# EAGLE design Design_Electronic_Proiect (EAGLE 9.7.0)

## Sheet 1 of 2
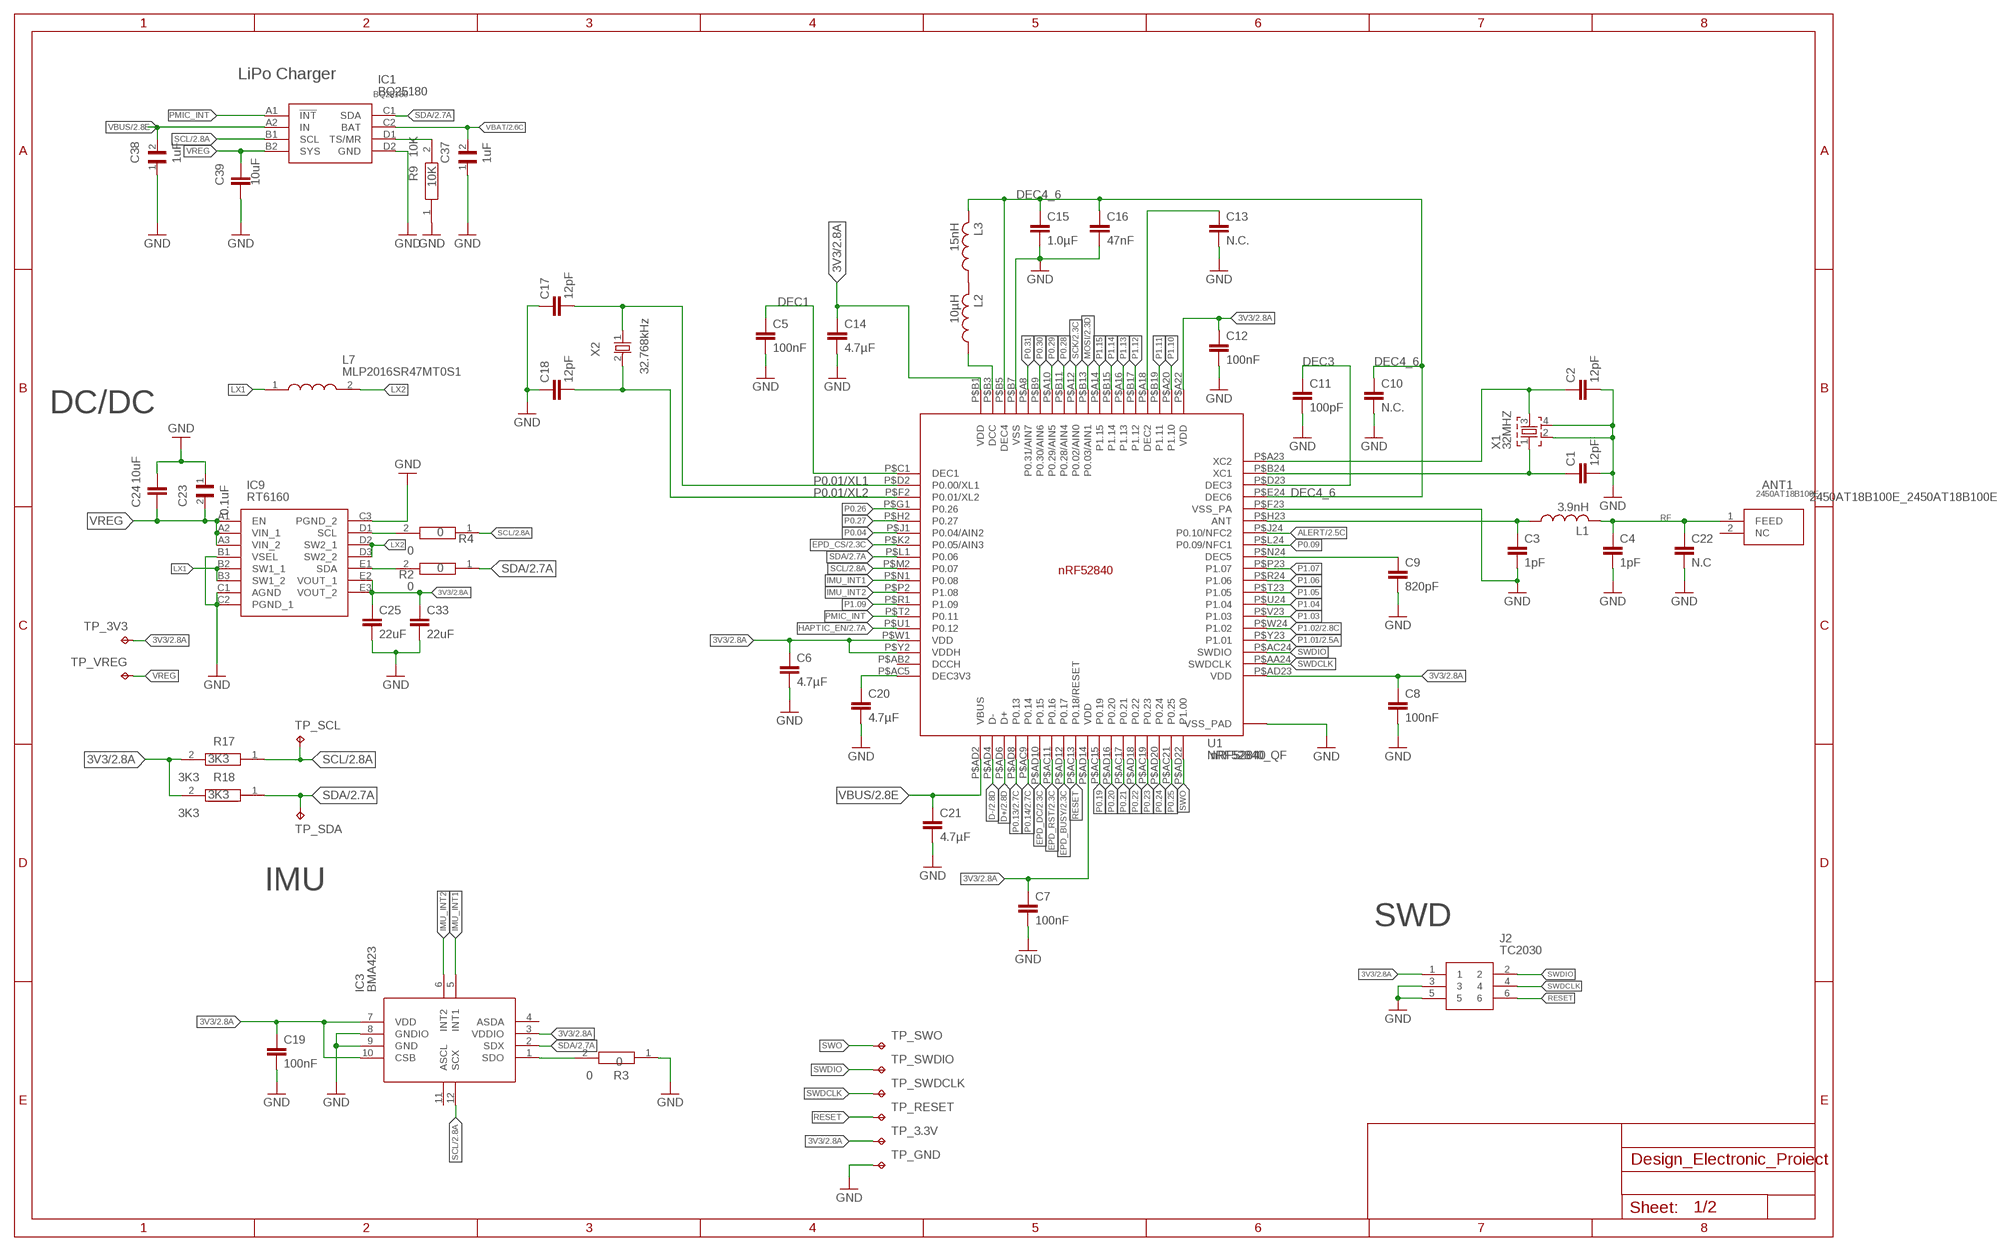
[diagram p0: schematic, sheet 1]

### Parts
ANT1  2450AT18B100E_2450AT18B100E  [2450AT18B100E_ANTC3216X140N]
C1  12pF  NORDIC_NRF_3_CAPACITOR_0201_L  [NORDIC_NRF_3_RESC0201_L]
C2  12pF  NORDIC_NRF_3_CAPACITOR_0201_L  [NORDIC_NRF_3_RESC0201_L]
C3  1pF  NORDIC_NRF_3_CAPACITOR_0201_L  [NORDIC_NRF_3_RESC0201_L]
C4  1pF  NORDIC_NRF_3_CAPACITOR_0201_L  [NORDIC_NRF_3_RESC0201_L]
C5  100nF  NORDIC_NRF_3_CAPACITOR_0201_L  [NORDIC_NRF_3_RESC0201_L]
C6  4.7µF  NORDIC_NRF_3_CAPACITOR_0201_L  [NORDIC_NRF_3_RESC0201_L]
C7  100nF  NORDIC_NRF_3_CAPACITOR_0201_L  [NORDIC_NRF_3_RESC0201_L]
C8  100nF  NORDIC_NRF_3_CAPACITOR_0201_L  [NORDIC_NRF_3_RESC0201_L]
C9  820pF  NORDIC_NRF_3_CAPACITOR_0201_L  [NORDIC_NRF_3_RESC0201_L]
C10  N.C.  NORDIC_NRF_3_CAPACITOR_0201_L  [NORDIC_NRF_3_RESC0201_L]
C11  100pF  NORDIC_NRF_3_CAPACITOR_0201_L  [NORDIC_NRF_3_RESC0201_L]
C12  100nF  NORDIC_NRF_3_CAPACITOR_0201_L  [NORDIC_NRF_3_RESC0201_L]
C13  N.C.  NORDIC_NRF_3_CAPACITOR_0201_L  [NORDIC_NRF_3_RESC0201_L]
C14  4.7µF  NORDIC_NRF_3_CAPACITOR_0201_L  [NORDIC_NRF_3_RESC0201_L]
C15  1.0µF  NORDIC_NRF_3_CAPACITOR_0201_L  [NORDIC_NRF_3_RESC0201_L]
C16  47nF  NORDIC_NRF_3_CAPACITOR_0201_L  [NORDIC_NRF_3_RESC0201_L]
C17  12pF  NORDIC_NRF_3_CAPACITOR_0201_L  [NORDIC_NRF_3_RESC0201_L]
C18  12pF  NORDIC_NRF_3_CAPACITOR_0201_L  [NORDIC_NRF_3_RESC0201_L]
C19  100nF  NORDIC_NRF_3_CAPACITOR_0402_L  [NORDIC_NRF_3_RESC0402_L]
C20  4.7µF  NORDIC_NRF_3_CAPACITOR_0201_L  [NORDIC_NRF_3_RESC0201_L]
C21  4.7µF  NORDIC_NRF_3_CAPACITOR_0201_L  [NORDIC_NRF_3_RESC0201_L]
C22  N.C  NORDIC_NRF_3_CAPACITOR_0201_L  [NORDIC_NRF_3_RESC0201_L]
C23  0.1uF  GRM011R60J152KE01L_2_GRM011R60J152KE01L  [GRM011R60J152KE01L_2_CAPC0201X13N]
C24  10uF  NORDIC_NRF_3_CAPACITOR_0402_L  [NORDIC_NRF_3_RESC0402_L]
C25  22uF  NORDIC_NRF_3_CAPACITOR_0402_L  [NORDIC_NRF_3_RESC0402_L]
C33  22uF  NORDIC_NRF_3_CAPACITOR_0402_L  [NORDIC_NRF_3_RESC0402_L]
C37  1uF  GRM011R60J152KE01L_2_GRM011R60J152KE01L  [GRM011R60J152KE01L_2_CAPC0201X13N]
C38  1uF  GRM011R60J152KE01L_2_GRM011R60J152KE01L  [GRM011R60J152KE01L_2_CAPC0201X13N]
C39  10uF  NORDIC_NRF_3_CAPACITOR_0402_L  [NORDIC_NRF_3_RESC0402_L]
IC1  BQ25180  BQ25180YBGR_BQ25180YBGR  [BQ25180YBGR_BGA8C40P2X4_100X155X50]
IC3  BMA423  BMA423_BMA423  [BMA423_BMA423]
IC9  RT6160  RT6160AWSC_RT6160AWSC  [RT6160AWSC_BGA15C40P3X5_140X230X60]
J2  TC2030  TC2030-IDC_TC2030-IDC  [TC2030-IDC_TC2030IDC]
L1  3.9nH  NORDIC_NRF_2_INDUCTOR_0402_L  [NORDIC_NRF_2_RESC0402_L]
L2  10µH  NORDIC_NRF_2_INDUCTOR_0402_L  [NORDIC_NRF_2_RESC0402_L]
L3  15nH  NORDIC_NRF_2_INDUCTOR_0402_L  [NORDIC_NRF_2_RESC0402_L]
L7  MLP2016SR47MT0S1  MLP2016SR47MT0S1_FTC252012SR47MBCA  [MLP2016SR47MT0S1_INDC2016X100N]
R2  0  CPF0201D7K68C1_CPF0201D7K68C1  [CPF0201D7K68C1_0201]
R3  0  CPF0201D7K68C1_CPF0201D7K68C1  [CPF0201D7K68C1_0201]
R4  0  CPF0201D7K68C1_CPF0201D7K68C1  [CPF0201D7K68C1_0201]
R9  10K  CPF0201D7K68C1_CPF0201D7K68C1  [CPF0201D7K68C1_0201]
R17  3K3  CPF0201D7K68C1_CPF0201D7K68C1  [CPF0201D7K68C1_0201]
R18  3K3  CPF0201D7K68C1_CPF0201D7K68C1  [CPF0201D7K68C1_0201]
TP_3.3V  HECTOR_WATCH_1_TPTP20R  [HECTOR_WATCH_1_TP20R]
TP_3V3  HECTOR_WATCH_1_TPTP20R  [HECTOR_WATCH_1_TP20R]
TP_GND  HECTOR_WATCH_1_TPTP20R  [HECTOR_WATCH_1_TP20R]
TP_RESET  HECTOR_WATCH_1_TPTP20R  [HECTOR_WATCH_1_TP20R]
TP_SCL  HECTOR_WATCH_1_TPTP20R  [HECTOR_WATCH_1_TP20R]
TP_SDA  HECTOR_WATCH_1_TPTP20R  [HECTOR_WATCH_1_TP20R]
TP_SWDCLK  HECTOR_WATCH_1_TPTP20R  [HECTOR_WATCH_1_TP20R]
TP_SWDIO  HECTOR_WATCH_1_TPTP20R  [HECTOR_WATCH_1_TP20R]
TP_SWO  HECTOR_WATCH_1_TPTP20R  [HECTOR_WATCH_1_TP20R]
TP_VREG  HECTOR_WATCH_1_TPTP20R  [HECTOR_WATCH_1_TP20R]
U1  nRF52840  NORDIC_NRF_4_NRF52840_QF  [NORDIC_NRF_4_AQFN50P700X700X85_HS-74N]
X1  32MHZ  NORDIC_NRF_XTAL_32MHZ  [NORDIC_NRF_BT-XTAL_2016_N]
X2  32.768kHz  NORDIC_NRF_1_XTAL_32KHZ  [NORDIC_NRF_1_XTAL_3215_N]

### Nets
3V3: C6.1 C7.1 C8.1 C12.1 C14.1 C19.1 C25.1 C33.1 IC3.3(VDDIO) IC3.7(VDD) IC3.10(CSB) IC9.E2(VOUT_1) IC9.E3(VOUT_2) J2.1 R17.2 R18.2 TP_3.3V.TP TP_3V3.TP U1.P$A22(VDD) U1.P$AD14(VDD) U1.P$AD23(VDD) U1.P$B1(VDD) U1.P$W1(VDD) U1.P$Y2(VDDH) ; also sheet 2
ALERT: U1.P$J24(P0.10/NFC2) ; also sheet 2
D+: U1.P$AD6(D+) ; also sheet 2
D-: U1.P$AD4(D-) ; also sheet 2
DEC1: C5.1 U1.P$C1(DEC1)
DEC3: C11.1 U1.P$D23(DEC3)
DEC4_6: C10.1 C15.1 C16.1 L3.2 U1.P$B5(DEC4) U1.P$E24(DEC6)
EPD_BUSY: U1.P$AD12(P0.17) ; also sheet 2
EPD_CS: U1.P$K2(P0.05/AIN3) ; also sheet 2
EPD_DC: U1.P$AD10(P0.15) ; also sheet 2
EPD_RST: U1.P$AC11(P0.16) ; also sheet 2
GND: C1.2 C2.2 C3.2 C4.2 C5.2 C6.2 C7.2 C8.2 C9.2 C10.2 C11.2 C12.2 C13.2 C14.2 C15.2 C16.2 C17.1 C18.1 C19.2 C20.2 C21.2 C22.2 C23.1 C24.1 C25.2 C33.2 C37.1 C38.1 C39.2 IC1.D2(GND) IC3.8(GNDIO) IC3.9(GND) IC9.B1(VSEL) IC9.C1(AGND) IC9.C2(PGND_1) IC9.C3(PGND_2) J2.3 J2.5 R3.1 R9.1 TP_GND.TP U1.P$74(VSS_PAD) U1.P$75(VSS_PAD) U1.P$76(VSS_PAD) U1.P$77(VSS_PAD) U1.P$78(VSS_PAD) U1.P$79(VSS_PAD) U1.P$80(VSS_PAD) U1.P$81(VSS_PAD) U1.P$82(VSS_PAD) U1.P$83(VSS_PAD) U1.P$84(VSS_PAD) U1.P$85(VSS_PAD) U1.P$86(VSS_PAD) U1.P$87(VSS_PAD) U1.P$88(VSS_PAD) U1.P$89(VSS_PAD) U1.P$90(VSS_PAD) U1.P$B7(VSS) U1.P$F23(VSS_PA) X1.2 X1.4 ; also sheet 2
HAPTIC_EN: U1.P$U1(P0.12) ; also sheet 2
IMU_INT1: IC3.5(INT1) U1.P$N1(P0.08)
IMU_INT2: IC3.6(INT2) U1.P$P2(P1.08)
LX1: IC9.B2(SW1_1) IC9.B3(SW1_2) L7.1
LX2: IC9.D2(SW2_1) IC9.D3(SW2_2) L7.2
MOSI: U1.P$B13(P0.03/AIN1) ; also sheet 2
N$1: C20.1 U1.P$AC5(DEC3V3)
N$2: C9.1 U1.P$N24(DEC5)
N$3: C3.1 L1.1 U1.P$H23(ANT)
N$4: C1.1 U1.P$B24(XC1) X1.1
N$5: C2.1 U1.P$A23(XC2) X1.3
N$6: L2.1 U1.P$B3(DCC)
N$7: L2.2 L3.1
N$8: C13.1 U1.P$A18(DEC2)
N$9: IC1.D1(TS/MR) R9.2
N$10: IC9.D1(SCL) R4.2
N$11: IC9.E1(SDA) R2.2
N$15: IC3.1(SDO) R3.2
P0.01/XL1: C17.2 U1.P$D2(P0.00/XL1) X2.1
P0.01/XL2: C18.2 U1.P$F2(P0.01/XL2) X2.2
P0.04: U1.P$J1(P0.04/AIN2)
P0.09: U1.P$L24(P0.09/NFC1)
P0.13: U1.P$AD8(P0.13) ; also sheet 2
P0.14: U1.P$AC9(P0.14) ; also sheet 2
P0.19: U1.P$AC15(P0.19)
P0.20: U1.P$AD16(P0.20)
P0.21: U1.P$AC17(P0.21)
P0.22: U1.P$AD18(P0.22)
P0.23: U1.P$AC19(P0.23)
P0.24: U1.P$AD20(P0.24)
P0.25: U1.P$AC21(P0.25)
P0.26: U1.P$G1(P0.26)
P0.27: U1.P$H2(P0.27)
P0.28: U1.P$B11(P0.28/AIN4)
P0.29: U1.P$A10(P0.29/AIN5)
P0.30: U1.P$B9(P0.30/AIN6)
P0.31: U1.P$A8(P0.31/AIN7)
P1.01: U1.P$Y23(P1.01) ; also sheet 2
P1.02: U1.P$W24(P1.02) ; also sheet 2
P1.03: U1.P$V23(P1.03)
P1.04: U1.P$U24(P1.04)
P1.05: U1.P$T23(P1.05)
P1.06: U1.P$R24(P1.06)
P1.07: U1.P$P23(P1.07)
P1.09: U1.P$R1(P1.09)
P1.10: U1.P$A20(P1.10)
P1.11: U1.P$B19(P1.11)
P1.12: U1.P$B17(P1.12)
P1.13: U1.P$A16(P1.13)
P1.14: U1.P$B15(P1.14)
P1.15: U1.P$A14(P1.15)
PMIC_INT: IC1.A1(!INT) U1.P$T2(P0.11)
RESET: J2.6 TP_RESET.TP U1.P$AC13(P0.18/RESET)
RF: ANT1.1(FEED) C4.1 C22.1 L1.2
SCK: U1.P$A12(P0.02/AIN0) ; also sheet 2
SCL: IC1.B1(SCL) IC3.12(SCX) R4.1 R17.1 TP_SCL.TP U1.P$M2(P0.07) ; also sheet 2
SDA: IC1.C1(SDA) IC3.2(SDX) R2.1 R18.1 TP_SDA.TP U1.P$L1(P0.06) ; also sheet 2
SWDCLK: J2.4 TP_SWDCLK.TP U1.P$AA24(SWDCLK)
SWDIO: J2.2 TP_SWDIO.TP U1.P$AC24(SWDIO)
SWO: TP_SWO.TP U1.P$AD22(P1.00)
VBAT: C37.2 IC1.C2(BAT) ; also sheet 2
VBUS: C21.1 C38.2 IC1.A2(IN) U1.P$AD2(VBUS) ; also sheet 2
VREG: C23.2 C24.2 C39.1 IC1.B2(SYS) IC9.A1(EN) IC9.A2(VIN_1) IC9.A3(VIN_2) TP_VREG.TP
Unconnected: ANT1.2(NC) IC3.4(ASDA) IC3.11(ASCL) U1.P$AB2(DCCH)

### Notes on the sheet
- LiPo Charger
- DC/DC
- IMU
- SWD

## Sheet 2 of 2
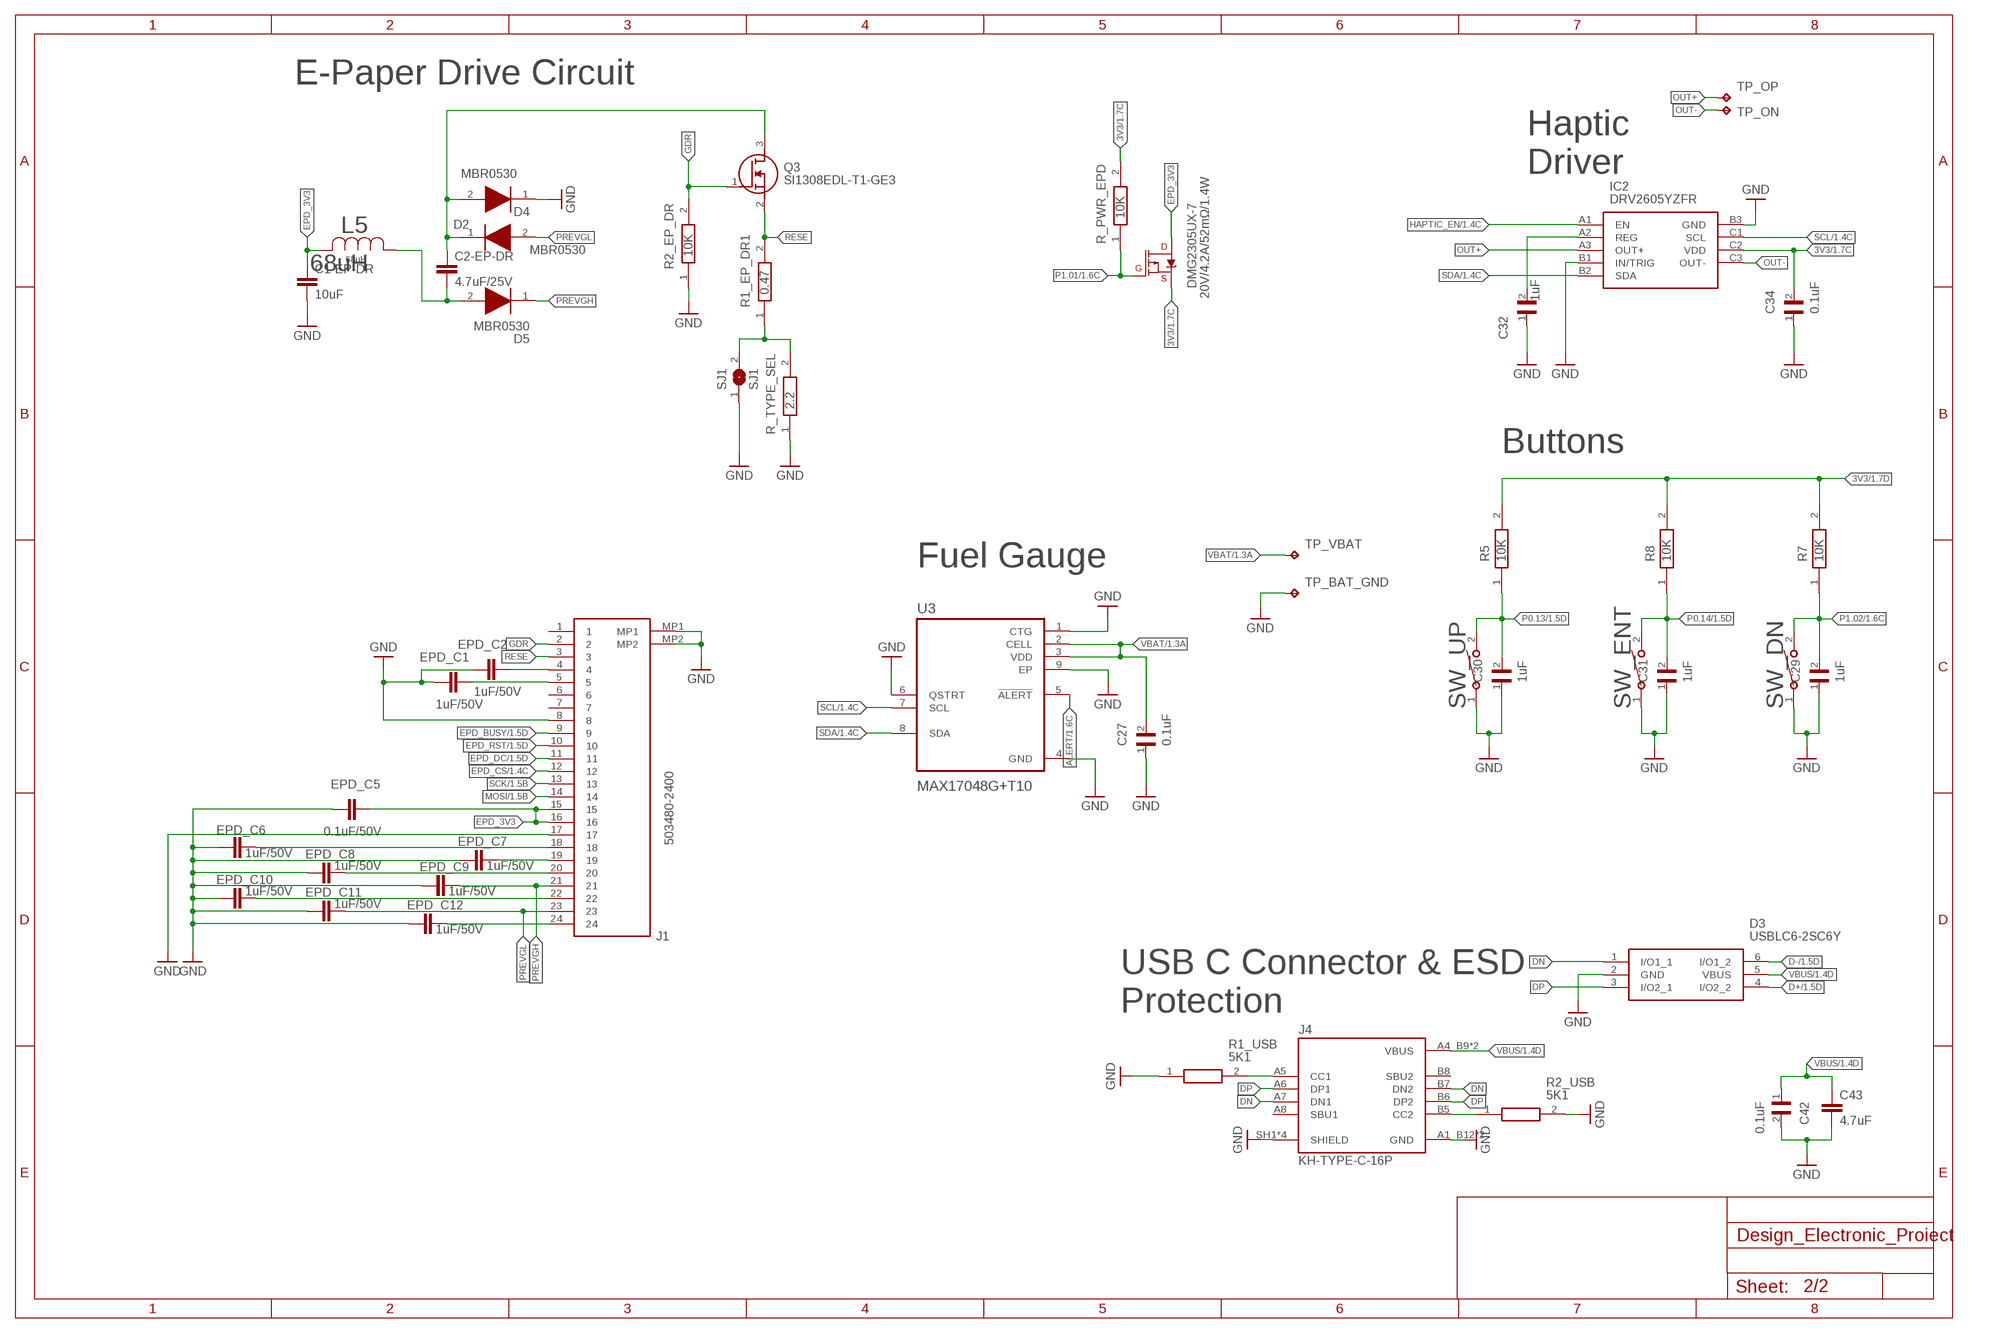
[diagram p1: schematic, sheet 2]

### Parts
C1-EP-DR  10uF  NORDIC_NRF_3_CAPACITOR_0402_L  [NORDIC_NRF_3_RESC0402_L]
C2-EP-DR  4.7uF/25V  NORDIC_NRF_3_CAPACITOR_0402_L  [NORDIC_NRF_3_RESC0402_L]
C27  0.1uF  GRM011R60J152KE01L_2_GRM011R60J152KE01L  [GRM011R60J152KE01L_2_CAPC0201X13N]
C29  1uF  GRM011R60J152KE01L_2_GRM011R60J152KE01L  [GRM011R60J152KE01L_2_CAPC0201X13N]
C30  1uF  GRM011R60J152KE01L_2_GRM011R60J152KE01L  [GRM011R60J152KE01L_2_CAPC0201X13N]
C31  1uF  GRM011R60J152KE01L_2_GRM011R60J152KE01L  [GRM011R60J152KE01L_2_CAPC0201X13N]
C32  1uF  GRM011R60J152KE01L_2_GRM011R60J152KE01L  [GRM011R60J152KE01L_2_CAPC0201X13N]
C34  0.1uF  GRM011R60J152KE01L_2_GRM011R60J152KE01L  [GRM011R60J152KE01L_2_CAPC0201X13N]
C42  0.1uF  GRM011R60J152KE01L_2_GRM011R60J152KE01L  [GRM011R60J152KE01L_2_CAPC0201X13N]
C43  4.7uF  NORDIC_NRF_3_CAPACITOR_0402_L  [NORDIC_NRF_3_RESC0402_L]
D2  MBR0530  ESP32_C6_LIBRARY_5_MBR0530  [ESP32_C6_LIBRARY_5_SOD3716X135N]
D3  USBLC6-2SC6Y  ESP32_C6_LIBRARY_3_USBLC6-2SC6Y  [ESP32_C6_LIBRARY_3_SOT95P280X145-6N]
D4  MBR0530  ESP32_C6_LIBRARY_5_MBR0530  [ESP32_C6_LIBRARY_5_SOD3716X135N]
D5  MBR0530  ESP32_C6_LIBRARY_5_MBR0530  [ESP32_C6_LIBRARY_5_SOD3716X135N]
DMG2305UX-7  20V/4.2A/52mΩ/1.4W  ESP32_C6_LIBRARY_4_ESP32_WROVER_SPARKFUN-DISCRETESEMI_MOSFET_PCH-DMG2305UX-7  [ESP32_C6_LIBRARY_4_ESP32_C6_LIBRARY_4_ESP32_C6_LIBRARY_4_ESP32_C6_LIBRARY_4_ESP32_WROVER_SPARKFUN-DISCRETESEMI_SOT23-3]
EPD_C1  1uF/50V  NORDIC_NRF_3_CAPACITOR_0402_L  [NORDIC_NRF_3_RESC0402_L]
EPD_C2  1uF/50V  NORDIC_NRF_3_CAPACITOR_0402_L  [NORDIC_NRF_3_RESC0402_L]
EPD_C5  0.1uF/50V  NORDIC_NRF_3_CAPACITOR_0402_L  [NORDIC_NRF_3_RESC0402_L]
EPD_C6  1uF/50V  NORDIC_NRF_3_CAPACITOR_0402_L  [NORDIC_NRF_3_RESC0402_L]
EPD_C7  1uF/50V  NORDIC_NRF_3_CAPACITOR_0402_L  [NORDIC_NRF_3_RESC0402_L]
EPD_C8  1uF/50V  NORDIC_NRF_3_CAPACITOR_0402_L  [NORDIC_NRF_3_RESC0402_L]
EPD_C9  1uF/50V  NORDIC_NRF_3_CAPACITOR_0402_L  [NORDIC_NRF_3_RESC0402_L]
EPD_C10  1uF/50V  NORDIC_NRF_3_CAPACITOR_0402_L  [NORDIC_NRF_3_RESC0402_L]
EPD_C11  1uF/50V  NORDIC_NRF_3_CAPACITOR_0402_L  [NORDIC_NRF_3_RESC0402_L]
EPD_C12  1uF/50V  NORDIC_NRF_3_CAPACITOR_0402_L  [NORDIC_NRF_3_RESC0402_L]
IC2  DRV2605YZFR  DRV2605YZFR_DRV2605YZFR  [DRV2605YZFR_BGA9C50P3X3_144X144X62]
J1  503480-2400  503480-2400_503480-2400  [503480-2400_5034802400]
J4  KH-TYPE-C-16P  KH-TYPE-C-16P_KH-TYPE-C-16P  [KH-TYPE-C-16P_KINGHELM_KH-TYPE-C-16P]
L5  68uH  ESP32_C6_LIBRARY_2_744043680IND_4828-WE-TPC_WRE  [ESP32_C6_LIBRARY_2_IND_4828-WE-TPC_WRE]
Q3  SI1308EDL-T1-GE3  ESP32_C6_LIBRARY_6_SI1308EDL-T1-GE3  [ESP32_C6_LIBRARY_6_SOT65P210X110-3N]
R1_EP_DR1  0.47  CPF0201D7K68C1_CPF0201D7K68C1  [CPF0201D7K68C1_0201]
R1_USB  5K1  CPF0201D7K68C1_CPF0201D7K68C1  [CPF0201D7K68C1_0201]
R2_EP_DR  10K  CPF0201D7K68C1_CPF0201D7K68C1  [CPF0201D7K68C1_0201]
R2_USB  5K1  CPF0201D7K68C1_CPF0201D7K68C1  [CPF0201D7K68C1_0201]
R5  10K  CPF0201D7K68C1_CPF0201D7K68C1  [CPF0201D7K68C1_0201]
R7  10K  CPF0201D7K68C1_CPF0201D7K68C1  [CPF0201D7K68C1_0201]
R8  10K  CPF0201D7K68C1_CPF0201D7K68C1  [CPF0201D7K68C1_0201]
R_PWR_EPD  10K  CPF0201D7K68C1_CPF0201D7K68C1  [CPF0201D7K68C1_0201]
R_TYPE_SEL  2.2  CPF0201D7K68C1_CPF0201D7K68C1  [CPF0201D7K68C1_0201]
SJ1  SJ1  ESP32_C6_LIBRARY_7_JUMPER_SJ  [ESP32_C6_LIBRARY_7_JUMPER_SJ]
SW_DN  2025-10-22_07-23-44_LIBRARY_EVP-AKE31ASW_EVP-AKE31A_PAN  [2025-10-22_07-23-44_LIBRARY_SW_EVP-AKE31A_PAN]
SW_ENT  2025-10-22_07-23-44_LIBRARY_EVP-AKE31ASW_EVP-AKE31A_PAN  [2025-10-22_07-23-44_LIBRARY_SW_EVP-AKE31A_PAN]
SW_UP  2025-10-22_07-23-44_LIBRARY_EVP-AKE31ASW_EVP-AKE31A_PAN  [2025-10-22_07-23-44_LIBRARY_SW_EVP-AKE31A_PAN]
TP_BAT_GND  HECTOR_WATCH_1_TPTP20R  [HECTOR_WATCH_1_TP20R]
TP_ON  HECTOR_WATCH_1_TPTP20R  [HECTOR_WATCH_1_TP20R]
TP_OP  HECTOR_WATCH_1_TPTP20R  [HECTOR_WATCH_1_TP20R]
TP_VBAT  HECTOR_WATCH_1_TPTP20R  [HECTOR_WATCH_1_TP20R]
U3  MAX17048G+T10  ESP32_C6_LIBRARY_MAX17048G+T10  [ESP32_C6_LIBRARY_SON50P200X200X80-9N]

### Nets
3V3: C34.2 DMG2305UX-7.2(S) IC2.C2(VDD) R_PWR_EPD.2 ; also sheet 1
3V3/1.7D: R5.2 R7.2 R8.2
ALERT: U3.5(!ALERT) ; also sheet 1
D+: D3.4(I/O2_2) ; also sheet 1
D-: D3.6(I/O1_2) ; also sheet 1
DN: D3.1(I/O1_1) J4.A7(DN1) J4.B7(DN2)
DP: D3.3(I/O2_1) J4.A6(DP1) J4.B6(DP2)
EPD_3V3: C1-EP-DR.1 DMG2305UX-7.3(D) EPD_C5.2 J1.15 J1.16 L5.2
EPD_BUSY: J1.9 ; also sheet 1
EPD_CS: J1.12 ; also sheet 1
EPD_DC: J1.11 ; also sheet 1
EPD_RST: J1.10 ; also sheet 1
GDR: J1.2 Q3.1(G) R2_EP_DR.2
GND: C1-EP-DR.2 C27.1 C29.1 C30.1 C31.1 C32.1 C34.1 C42.2 C43.2 D3.2(GND) D4.1(K) EPD_C1.1 EPD_C2.1 EPD_C5.1 EPD_C6.1 EPD_C7.1 EPD_C8.1 EPD_C9.1 EPD_C10.1 EPD_C11.1 EPD_C12.1 IC2.B1(IN/TRIG) IC2.B3(GND) J1.8 J1.17 J1.MP1 J1.MP2 J4.A1_B12(GND) J4.A12_B1(GND) J4.SH1(SHIELD) J4.SH2(SHIELD) J4.SH3(SHIELD) J4.SH4(SHIELD) R1_USB.1 R2_EP_DR.1 R2_USB.2 R_TYPE_SEL.1 SJ1.1 SW_DN.1 SW_ENT.1 SW_UP.1 TP_BAT_GND.TP U3.1(CTG) U3.4(GND) U3.6(QSTRT) U3.9(EP) ; also sheet 1
HAPTIC_EN: IC2.A1(EN) ; also sheet 1
MOSI: J1.14 ; also sheet 1
N$12: C2-EP-DR.2 D5.2(A) L5.1
N$13: C2-EP-DR.1 D2.1(K) D4.2(A) Q3.3(D)
N$14: R1_EP_DR1.1 R_TYPE_SEL.2 SJ1.2
N$16: C32.2 IC2.A2(REG)
N$17: J4.A5(CC1) R1_USB.2
N$18: EPD_C2.2 J1.4
N$19: J4.B5(CC2) R2_USB.1
N$20: EPD_C1.2 J1.5
N$21: EPD_C6.2 J1.18
N$22: EPD_C7.2 J1.19
N$23: EPD_C8.2 J1.20
N$24: EPD_C10.2 J1.22
N$26: EPD_C12.2 J1.24
OUT+: IC2.A3(OUT+) TP_OP.TP
OUT-: IC2.C3(OUT-) TP_ON.TP
P0.13: C30.2 R5.1 SW_UP.2 ; also sheet 1
P0.14: C31.2 R8.1 SW_ENT.2 ; also sheet 1
P1.01: DMG2305UX-7.1(G) R_PWR_EPD.1 ; also sheet 1
P1.02: C29.2 R7.1 SW_DN.2 ; also sheet 1
PREVGH: D5.1(K) EPD_C9.2 J1.21
PREVGL: D2.2(A) EPD_C11.2 J1.23
RESE: J1.3 Q3.2(S) R1_EP_DR1.2
SCK: J1.13 ; also sheet 1
SCL: IC2.C1(SCL) U3.7(SCL) ; also sheet 1
SDA: IC2.B2(SDA) U3.8(SDA) ; also sheet 1
VBAT: C27.2 TP_VBAT.TP U3.2(CELL) U3.3(VDD) ; also sheet 1
VBUS: C42.1 C43.1 D3.5(VBUS) J4.A4_B9(VBUS) J4.A9_B4(VBUS) ; also sheet 1
Unconnected: J1.1 J1.6 J1.7 J4.A8(SBU1) J4.B8(SBU2)

### Notes on the sheet
- E-Paper Drive Circuit
- Haptic
  Driver
- Buttons
- Fuel Gauge
- USB C Connector & ESD
  Protection

## Library data of the parts
ANT1 = InkTime_v5:2450AT18B100E_2450AT18B100E: Antennas 2.45GHz ANTENNA Source: Datasheet <https://www.johansontechnology.com/datasheets/2450AT18B100/2450AT18B100.pdf>; ARROW_PART_NUMBER: 2450AT18B100E; ARROW_PRICE-STOCK: https://www.arrow.com/en/products/2450at18b100e/johanson-dielectrics?utm_currency=USD&region=nac; DESCRIPTION: Antennas 2.45GHz ANTENNA; HEIGHT: 1.4mm; MANUFACTURER_NAME: JOHANSON TECHNOLOGY; MANUFACTURER_PART_NUMBER: 2450AT18B100E; MOUSER_PART_NUMBER: 609-2450AT18B100E; MOUSER_PRICE-STOCK: https://www.mouser.co.uk/ProductDetail/Johanson-Technology/2450AT18B100E?qs=yCnrNFeXz%252Bh5MFsFIXGZGA%3D%3D
C1 C1-EP-DR C2 C2-EP-DR C3-C22 C24 C25 C33 C39 C43 EPD_C1 EPD_C2 EPD_C5-EPD_C12 = InkTime_v5:NORDIC_NRF_3_CAPACITOR: Generic chip capacitor
C23 C27 C29-C32 C34 C37 C38 C42 = InkTime_v5:GRM011R60J152KE01L_2_GRM011R60J152KE01L: Check availability <https://pricing.snapeda.com/parts/GRM011R60J152KE01L/Murata/view-part?ref=eda>; AVAILABILITY: In Stock; CHECK_PRICES: https://www.snapeda.com/parts/GRM011R60J152KE01L/Murata/view-part/?ref=eda; DESCRIPTION: SMD Capacitor X5R(EIA) with Capacitance: 1500pF Tol. 10%. Rated Voltage: 6.3Vdc; MF: Murata; MP: GRM011R60J152KE01L; PACKAGE: 0201 Murata; PRICE: None; SNAPEDA_LINK: https://www.snapeda.com/parts/GRM011R60J152KE01L/Murata/view-part/?ref=snap
D2 D4 D5 = InkTime_v5:ESP32_C6_LIBRARY_5_MBR0530: ON SEMICONDUCTOR - MBR0530 - DIODE, SCHOTTKY, 0.5A, 30V, SOD-123 Source: Datasheet <http://www.onsemi.com/pub/Collateral/MBR0530T1-D.PDF> Check availability <https://pricing.snapeda.com/parts/MBR0530/ON%20Semiconductor/view-part?ref=eda>; AVAILABILITY: In Stock; CHECK_PRICES: https://www.snapeda.com/parts/MBR0530/Onsemi/view-part/?ref=eda; DESCRIPTION: Diode Schottky 30 V 500mA Surface Mount SOD-123; MF: ON Semiconductor; MP: MBR0530; PACKAGE: SOD-123-2 ON Semiconductor; PRICE: None; PURCHASE-URL: https://www.snapeda.com/api/url_track_click_mouser/?unipart_id=179458&manufacturer=ON Semiconductor&part_name=MBR0530&search_term=None; SNAPEDA_LINK: https://www.snapeda.com/parts/MBR0530/Onsemi/view-part/?ref=snap
D3 = InkTime_v5:ESP32_C6_LIBRARY_3_USBLC6-2SC6Y: Low Cap. ESD Protection Auto SOT-23-6 STMicroelectronics USBLC6-2SC6Y, Dual Uni-Directional TVS Diode Array, 6-Pin SOT-23 Source: Datasheet <https://componentsearchengine.com/Datasheets/1/USBLC6-2SC6Y.pdf> Check availability <https://pricing.snapeda.com/parts/USBLC6-2SC6Y/STMicroelectronics/view-part?ref=eda>; AVAILABILITY: In Stock; CHECK_PRICES: https://www.snapeda.com/parts/USBLC6-2SC6Y/STMicroelectronics/view-part/?ref=eda; DESCRIPTION: 17V Clamp 5A (8/20µs) Ipp Tvs Diode Surface Mount SOT-23-6; MF: STMicroelectronics; MP: USBLC6-2SC6Y; PACKAGE: SOT-23-6 STMicroelectronics; PRICE: None; SNAPEDA_LINK: https://www.snapeda.com/parts/USBLC6-2SC6Y/STMicroelectronics/view-part/?ref=snap
DMG2305UX-7 = InkTime_v5:ESP32_C6_LIBRARY_4_ESP32_WROVER_SPARKFUN-DISCRETESEMI_MOSFET_PCH: P-channel MOSFETs Voltage controlled devices that allow control of high current outputs. SparkFun Products: SparkFun ESP32 Thing <https://www.sparkfun.com/products/13907> SparkFun ESP8266 Thing <https://www.sparkfun.com/products/13231> SparkFun Pi Servo HAT V2 <https://www.sparkfun.com/products/15316> DMG2305UX-7 (20V/4.2A/SOT23-3); PROD_ID: TRAN-14388
IC1 = InkTime_v5:BQ25180YBGR_BQ25180YBGR: Charger IC Lithium Ion/Polymer, Lithium Iron Phosphate 8-DSBGA (1.6x1.1) Source: Datasheet <https://www.ti.com/lit/ds/symlink/bq25180.pdf?ts=1650264094470&ref_url=https%3A%2F%2Fwww.ti.com%2Fproduct%2FBQ25180>; ARROW_PART_NUMBER: BQ25180YBGR; ARROW_PRICE-STOCK: https://www.arrow.com/en/products/bq25180ybgr/texas-instruments?utm_currency=USD&region=nac; DESCRIPTION: Charger IC Lithium Ion/Polymer, Lithium Iron Phosphate 8-DSBGA (1.6x1.1); HEIGHT: 0.5mm; MANUFACTURER_NAME: Texas Instruments; MANUFACTURER_PART_NUMBER: BQ25180YBGR; MOUSER_PART_NUMBER: 595-BQ25180YBGR; MOUSER_PRICE-STOCK: https://www.mouser.co.uk/ProductDetail/Texas-Instruments/BQ25180YBGR?qs=doiCPypUmgEWjAK%252BJAX6Tw%3D%3D
IC2 = InkTime_v5:DRV2605YZFR_DRV2605YZFR: Haptic Driver for ERM/LRA with Built-In Library and Smart Loop Architecture Source: Datasheet <http://www.ti.com/lit/gpn/drv2605>; ARROW_PART_NUMBER: DRV2605YZFR; ARROW_PRICE-STOCK: https://www.arrow.com/en/products/drv2605yzfr/texas-instruments?region=nac; DESCRIPTION: Haptic Driver for ERM/LRA with Built-In Library and Smart Loop Architecture; HEIGHT: 0.625mm; MANUFACTURER_NAME: Texas Instruments; MANUFACTURER_PART_NUMBER: DRV2605YZFR
IC3 = InkTime_v5:BMA423_BMA423: Accelerometers Triaxial low-g 12bit Acceleration Sensor Source: Datasheet <https://www.mouser.com/datasheet/2/783/BST-BMA423-DS000-1509600.pdf>; ARROW_PART_NUMBER: BMA423; ARROW_PRICE-STOCK: https://www.arrow.com/en/products/bma423/bosch; DESCRIPTION: Accelerometers Triaxial low-g 12bit Acceleration Sensor; HEIGHT: 1mm; MANUFACTURER_NAME: BOSCH; MANUFACTURER_PART_NUMBER: BMA423; MOUSER_PART_NUMBER: 262-BMA423; MOUSER_PRICE-STOCK: https://www.mouser.co.uk/ProductDetail/Bosch-Sensortec/BMA423?qs=HXFqYaX1Q2xC%252BSgeGoX3mg%3D%3D
IC9 = InkTime_v5:RT6160AWSC_RT6160AWSC: Buck-Boost Regulator Positive Output Step-Up/Step-Down I2C DC-DC Controller IC 15-WL-CSP (BSC) (1.4x2.3) Source: Datasheet <https://www.richtek.com/SaveDownload.aspx?specid=RT6160A>; DESCRIPTION: Buck-Boost Regulator Positive Output Step-Up/Step-Down I2C DC-DC Controller IC 15-WL-CSP (BSC) (1.4x2.3); HEIGHT: 0.6mm; MANUFACTURER_NAME: RICHTEK; MANUFACTURER_PART_NUMBER: RT6160AWSC; MOUSER_PART_NUMBER: 835-RT6160AWSC; MOUSER_PRICE-STOCK: https://www.mouser.co.uk/ProductDetail/Richtek/RT6160AWSC?qs=amGC7iS6iy%2FLd9PSoixZXQ%3D%3D
J1 = InkTime_v5:503480-2400_503480-2400: FFC & FPC Connectors 0.5mm FPC RA SMT Dual Contact 24Ckt Source: Datasheet <https://componentsearchengine.com/Datasheets/1/503480-2400.pdf>; DESCRIPTION: FFC & FPC Connectors 0.5mm FPC RA SMT Dual Contact 24Ckt; HEIGHT: 1.87mm; MANUFACTURER_NAME: Molex; MANUFACTURER_PART_NUMBER: 503480-2400; MOUSER_PART_NUMBER: 538-503480-2400; MOUSER_PRICE-STOCK: https://www.mouser.co.uk/ProductDetail/Molex/503480-2400?qs=OAhjpuo3Vu7efIoxFh9AOw%3D%3D
J2 = InkTime_v5:TC2030-IDC_TC2030-IDC: CABLE ADAPTER 6 POS Source: Datasheet <https://datasheet.datasheetarchive.com/originals/distributors/Datasheets_SAMA/62bc384e093448baaaa63dbd0b9d8707.pdf>; DESCRIPTION: CABLE ADAPTER 6 POS; HEIGHT: 19mm; MANUFACTURER_NAME: Tag Connect; MANUFACTURER_PART_NUMBER: TC2030-IDC
J4 = InkTime_v5:KH-TYPE-C-16P_KH-TYPE-C-16P: Check availability <https://pricing.snapeda.com/parts/KH-TYPE-C-16P/kinghelm/view-part?ref=eda>; AVAILABILITY: Not in stock; CHECK_PRICES: https://www.snapeda.com/parts/KH-TYPE-C-16P/Kinghelm/view-part/?ref=eda; MF: kinghelm; MP: KH-TYPE-C-16P; PACKAGE: None; PRICE: None; SNAPEDA_LINK: https://www.snapeda.com/parts/KH-TYPE-C-16P/Kinghelm/view-part/?ref=snap
L1-L3 = InkTime_v5:NORDIC_NRF_2_INDUCTOR: Generic chip inductor
L5 = InkTime_v5:ESP32_C6_LIBRARY_2_744043680; COPYRIGHT: Copyright (C) 2024 Ultra Librarian. All rights reserved.; MANUFACTURER_PART_NUMBER: 744043680; MFR_NAME: Wurth Electronics; SHOW_VALUE: 68uH
L7 = InkTime_v5:MLP2016SR47MT0S1_FTC252012SR47MBCA: SMD / SMT Inductors (Coils), L=0.47?H, L x W x T : Source: Datasheet <https://product.tdk.com/system/files/dam/doc/product/inductor/inductor/smd/catalog/inductor_commercial_power_mlp2016_en.pdf>; DESCRIPTION: SMD / SMT Inductors (Coils), L=0.47?H, L x W x T :; HEIGHT: 1mm; JLCPCB: https://jlcpcb.com/partdetail/6763488-FTC252012SR47MBCA/C5832368; MANUFACTURER_NAME: TDK; MANUFACTURER_PART_NUMBER: FTC252012SR47MBCA
Q3 = InkTime_v5:ESP32_C6_LIBRARY_6_SI1308EDL-T1-GE3: MOSFET N-Ch 30V 1.5A TrenchFET SC70 Vishay Si1308EDL-T1-GE3 N-channel MOSFET Transistor, 1.5 A, 30 V, 3-Pin SC-70 Source: Datasheet <https://componentsearchengine.com/Datasheets/1/SI1308EDL-T1-GE3.pdf> Check availability <https://pricing.snapeda.com/parts/SI1308EDL-T1-GE3/Vishay%20Siliconix/view-part?ref=eda>; AVAILABILITY: In Stock; CHECK_PRICES: https://www.snapeda.com/parts/SI1308EDL-T1-GE3/Vishay+Siliconix/view-part/?ref=eda; DESCRIPTION: Si1308EDL-T1-GE3 N-channel MOSFET Transistor, 1.5 A, 30 V, 3-Pin SC-70 | Siliconix / Vishay SI1308EDL-T1-GE3; MF: Vishay Siliconix; MP: SI1308EDL-T1-GE3; PACKAGE: SOT-323 Vishay Semiconductor; PRICE: None; PURCHASE-URL: https://www.snapeda.com/api/url_track_click_mouser/?unipart_id=274603&manufacturer=Vishay Siliconix&part_name=SI1308EDL-T1-GE3&search_term=None; SNAPEDA_LINK: https://www.snapeda.com/parts/SI1308EDL-T1-GE3/Vishay+Siliconix/view-part/?ref=snap
R1_EP_DR1 R1_USB R2_EP_DR R2_USB R5 R7 R8 R_PWR_EPD R_TYPE_SEL = InkTime_v5:CPF0201D7K68C1_CPF0201D7K68C1: 7.68k 0201 Thin Film Surface Mount Fixed Resistor +/-0.5% 0.031W CPF0201D7K68C1 Source: Datasheet <http://www.te.com/commerce/DocumentDelivery/DDEController?Action=showdoc&DocId=Data Sheet1773200-1ApdfEnglishENG_DS_1773200-1_A.pdf4-2176215-6>
R2-R4 = InkTime_v5:CPF0201D7K68C1_CPF0201D7K68C1: 7.68k 0201 Thin Film Surface Mount Fixed Resistor +/-0.5% 0.031W CPF0201D7K68C1 Source: Datasheet <http://www.te.com/commerce/DocumentDelivery/DDEController?Action=showdoc&DocId=Data Sheet1773200-1ApdfEnglishENG_DS_1773200-1_A.pdf4-2176215-6>; R1: 0
R9 = InkTime_v5:CPF0201D7K68C1_CPF0201D7K68C1: 7.68k 0201 Thin Film Surface Mount Fixed Resistor +/-0.5% 0.031W CPF0201D7K68C1 Source: Datasheet <http://www.te.com/commerce/DocumentDelivery/DDEController?Action=showdoc&DocId=Data Sheet1773200-1ApdfEnglishENG_DS_1773200-1_A.pdf4-2176215-6>; R1: 10K
R17 R18 = InkTime_v5:CPF0201D7K68C1_CPF0201D7K68C1: 7.68k 0201 Thin Film Surface Mount Fixed Resistor +/-0.5% 0.031W CPF0201D7K68C1 Source: Datasheet <http://www.te.com/commerce/DocumentDelivery/DDEController?Action=showdoc&DocId=Data Sheet1773200-1ApdfEnglishENG_DS_1773200-1_A.pdf4-2176215-6>; R1: 3K3
SJ1 = InkTime_v5:ESP32_C6_LIBRARY_7_JUMPER_SJ: SMD solder JUMPER
SW_DN SW_ENT SW_UP = InkTime_v5:2025-10-22_07-23-44_LIBRARY_EVP-AKE31A; COPYRIGHT: Copyright (C) 2025 Ultra Librarian. All rights reserved.; DIGI-KEY_PART_NUMBER_1: P123437TR-ND; DIGI-KEY_PART_NUMBER_2: P123437CT-ND; DIGI-KEY_PART_NUMBER_3: P123437DKR-ND; MANUFACTURER_NAME: Panasonic; MANUFACTURER_PART_NUMBER: EVP-AKE31A
TP_3.3V TP_3V3 TP_BAT_GND TP_GND TP_ON TP_OP TP_RESET TP_SCL TP_SDA TP_SWDCLK TP_SWDIO TP_SWO TP_VBAT TP_VREG = InkTime_v5:HECTOR_WATCH_1_TP: Test pad
U1 = InkTime_v5:NORDIC_NRF_4_NRF52840_QF: nRF52840 Features Advanced Single chip 2.4 GHz multi-protocol SoC 32-bit ARM Cortex-M4F Processor 1.7v to 5.5v operation 1MB flash + 256kB RAM Bluetooth 5 support for long range and high throughput 802.15.4 radio support On-chip NFC PPI –Programmable Peripheral Interconnect Automated power management system with automatic power management of each peripheral Configurable I/O mapping for analog and digital I/O 48 x GPIO 1 x QSPI 4 x Master/Slave SPI 2 x Two-wire interface (I²C) I²S interface 2 x UART 4 x PWM USB 2.0 controller ARM TrustZone CryptoCell-310 Cryptographic and security module AES 128-bit ECB/CCM/AAR hardware accelerator Digital microphone interface (PDM) Quadrature decoder 12-bit ADC Low power comparator On-chip 50Ω balun On-air compatible with nRF52, nRF51 and nRF24 Series Applications Advanced high performance wearables Wearables for secure payments Virtual Reality/Augmented Reality systems Smart Home sensor networks Smart city sensor networks High performance HID controllers Internet of Things (IoT) sensor networks Smart door locks Smart lighting networks Connected white goods
U3 = InkTime_v5:ESP32_C6_LIBRARY_MAX17048G+T10: Check availability <https://pricing.snapeda.com/parts/MAX17048G%2BT10/Analog%20Devices/view-part?ref=eda>; AVAILABILITY: In Stock; CHECK_PRICES: https://www.snapeda.com/parts/MAX17048G+T10/Analog+Devices/view-part/?ref=eda; DESCRIPTION: 3µA 1-Cell/2-Cell Fuel Gauge with ModelGauge; MF: Analog Devices; MP: MAX17048G+T10; PACKAGE: TDFN-8 Maxim; PRICE: None; PURCHASE-URL: https://www.snapeda.com/api/url_track_click_mouser/?unipart_id=329239&manufacturer=Analog Devices&part_name=MAX17048G+T10&search_term=None; SNAPEDA_LINK: https://www.snapeda.com/parts/MAX17048G+T10/Analog+Devices/view-part/?ref=snap
X1 = InkTime_v5:NORDIC_NRF_XTAL_32MHZ
X2 = InkTime_v5:NORDIC_NRF_1_XTAL_32KHZ

## Board
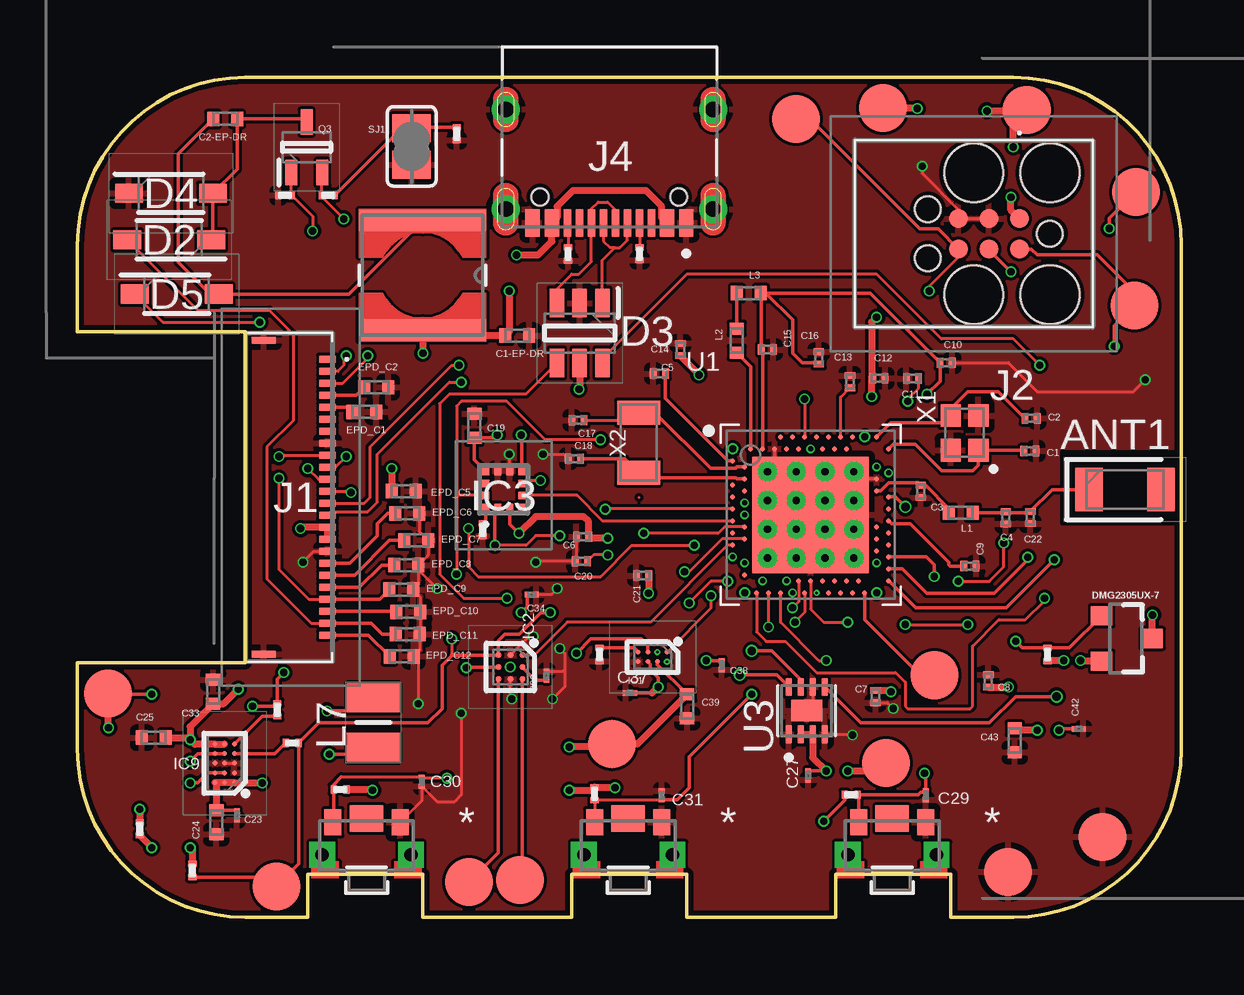
[diagram p2: board, top side]
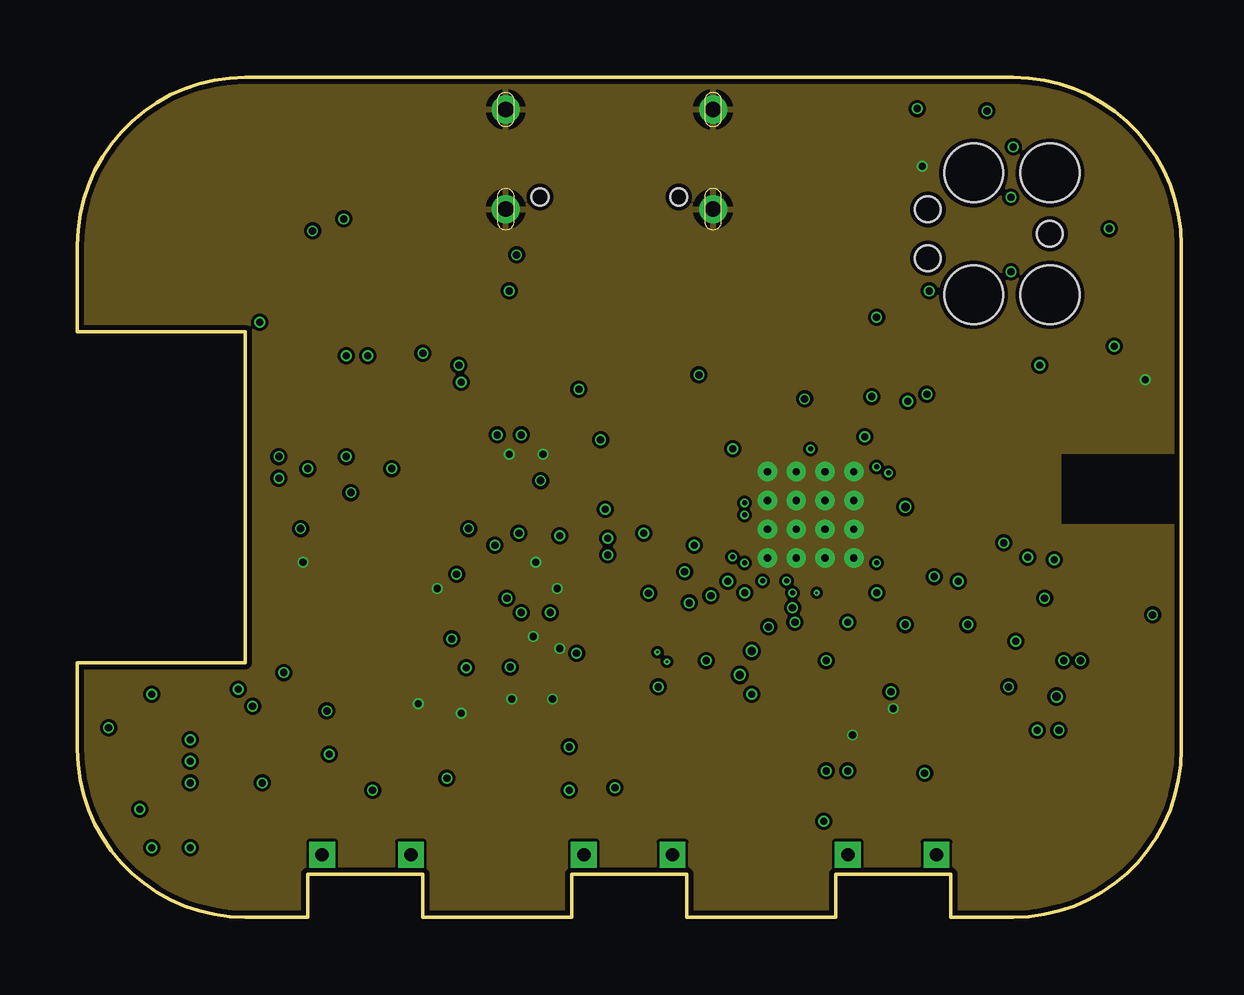
[diagram p3: board, inner layer Route2]
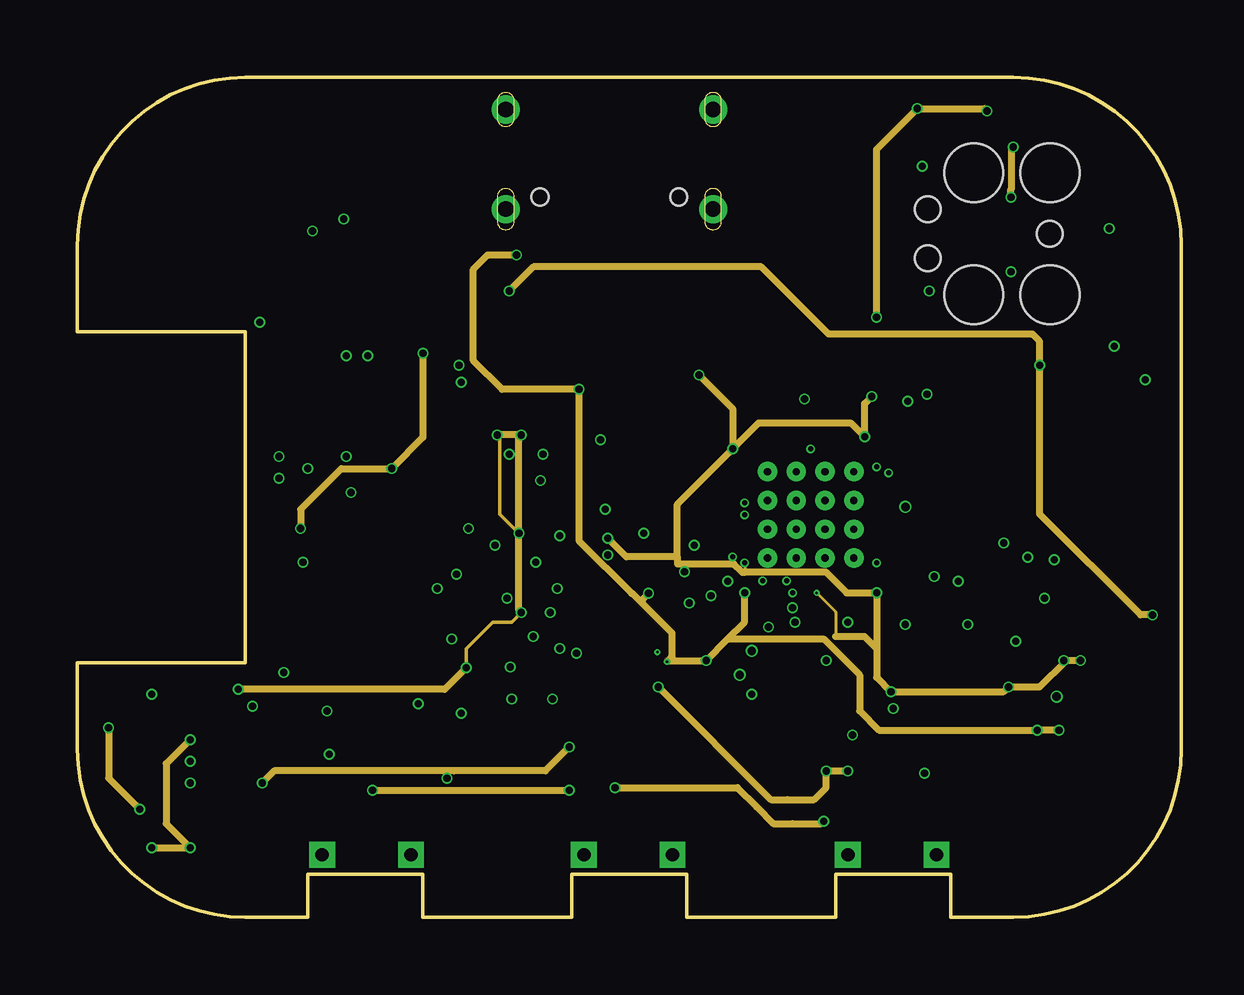
[diagram p4: board, inner layer Route15]
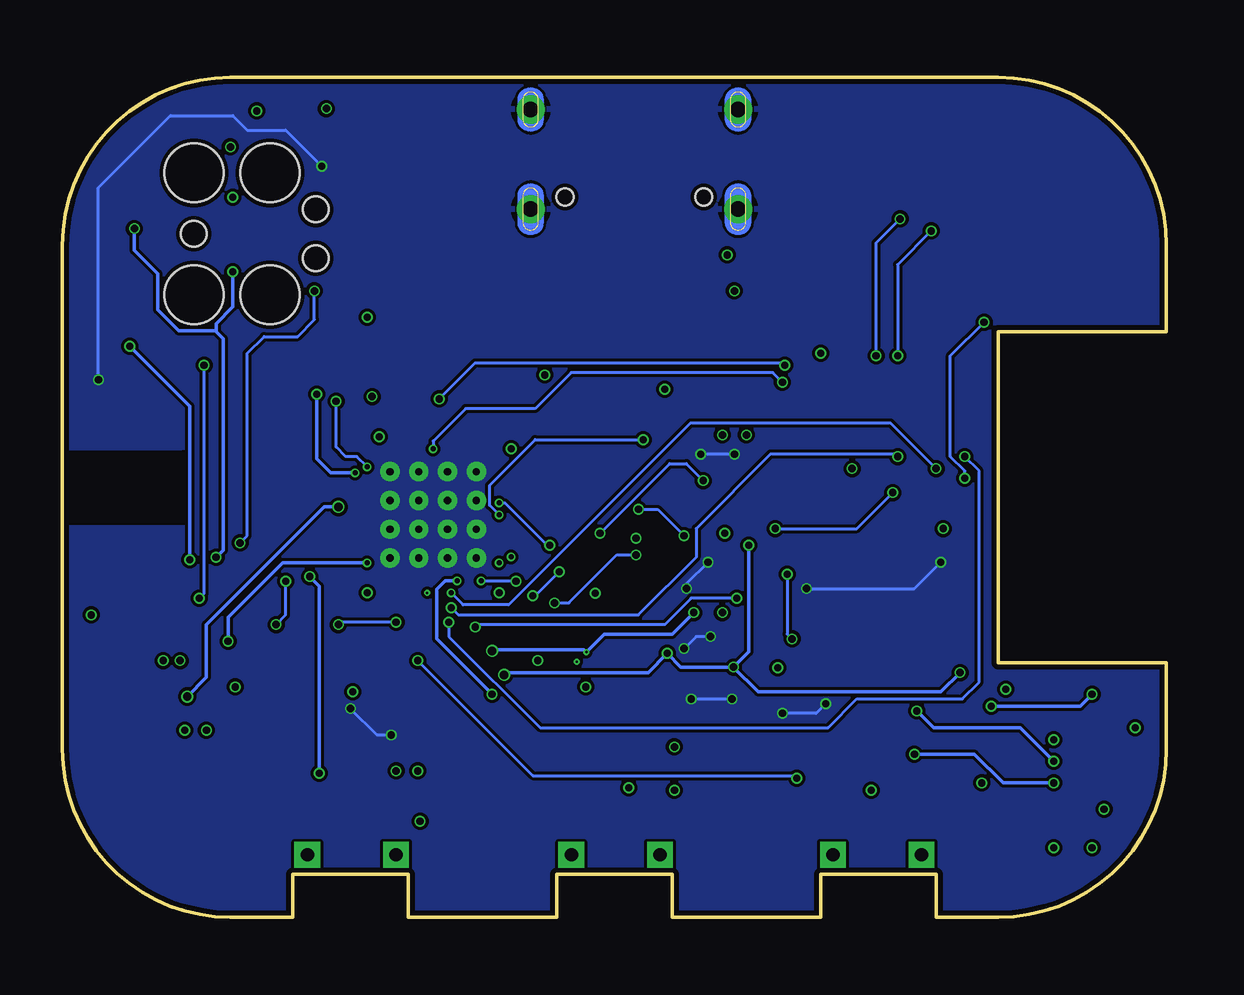
[diagram p5: board, bottom side, seen from below]

Size 46 x 35 mm. Coordinates in mm from the lower left corner, seen from the top.
Outline: 39,0 36.4,0 36.4,1.8 31.6,1.8 31.6,0 25.4,0 25.4,1.8 20.6,1.8 20.6,0 14.4,0 14.4,1.8 9.6,1.8 9.6,0 7,0 arc-90 0,7 0,10.6 7,10.6 7,24.4 0,24.4 0,28 arc-90 7,35 39,35 arc-90 46,28 46,7 arc-90 39,0
Copper layers (1*16): Top 0.035mm / dielectric 1.6mm / Bottom 0.035mm
Design rules "jlcpcb-2layers.dru *": minimum track width 5mil, minimum drill 0.3mm, track to track 5mil, track to pad 5mil, pad to pad 5mil, via to via 5mil, smd to smd 5mil, copper to edge 0.2mm, drill to drill 6mil, minimum pad ring 10mil, minimum via ring 3mil, stop-mask expansion 4mil, vias tented up to drill 0mil, thermal gap 10mil
tRestrict: 5 lines
bRestrict: 5 lines
vRestrict: 5 lines

### Footprints (pad centres in the part's own frame; a part is rotated, then mirrored left to right if it is on the bottom)
2450AT18B100E_ANTC3216X140N = smd 1.15 x 1.8: 1 -1.5,0; 2 1.5,0
NORDIC_NRF_3_RESC0201_L = smd 0.28 x 0.43: 1 -0.255,0; 2 0.255,0
NORDIC_NRF_3_RESC0402_L = smd 0.5 x 0.6: 1 -0.5,0; 2 0.5,0
GRM011R60J152KE01L_2_CAPC0201X13N = smd 0.22 x 0.23: 1 -0.185,0; 2 0.185,0
ESP32_C6_LIBRARY_5_SOD3716X135N = smd 1.15 x 0.8: 1 -1.75,0; 2 1.75,0
ESP32_C6_LIBRARY_3_SOT95P280X145-6N = smd 1.2 x 0.6: 1 -1.25,0.95; 2 -1.25,0; 3 -1.25,-0.95; 4 1.25,-0.95; 5 1.25,0; 6 1.25,0.95
ESP32_C6_LIBRARY_4_ESP32_C6_LIBRARY_4_ESP32_C6_LIBRARY_4_ESP32_C6_LIBRARY_4_ESP32_WROVER_SPARKFUN-DISCRETESEMI_SOT23-3 = smd 0.8 x 0.9: 1 -0.95,-1; 2 0.95,-1; 3 0,1.1
BQ25180YBGR_BGA8C40P2X4_100X155X50 = smd 0.2 x 0.2: A1 -0.2,0.6; A2 0.2,0.6; B1 -0.2,0.2; B2 0.2,0.2; C1 -0.2,-0.2; C2 0.2,-0.2; D1 -0.2,-0.6; D2 0.2,-0.6
DRV2605YZFR_BGA9C50P3X3_144X144X62 = smd 0.25 x 0.25: A1 -0.5,0.5; A2 0,0.5; A3 0.5,0.5; B1 -0.5,0; B2 0,0; B3 0.5,0; C1 -0.5,-0.5; C2 0,-0.5; C3 0.5,-0.5
BMA423_BMA423 = smd 0.3 x 0.35: 1 -0.75,-0.775; 2 -0.25,-0.775; 3 0.25,-0.775; 4 0.75,-0.775; 7 0.75,0.775; 8 0.25,0.775; 9 -0.25,0.775; 10 -0.75,0.775 | smd 0.35 x 0.3: 5 0.775,-0.25; 6 0.775,0.25; 11 -0.775,0.25; 12 -0.775,-0.25
RT6160AWSC_BGA15C40P3X5_140X230X60 = smd 0.216 x 0.216: A1 -0.4,0.8; A2 0,0.8; A3 0.4,0.8; B1 -0.4,0.4; B2 0,0.4; B3 0.4,0.4; C1 -0.4,0; C2 0,0; C3 0.4,0; D1 -0.4,-0.4; D2 0,-0.4; D3 0.4,-0.4; E1 -0.4,-0.8; E2 0,-0.8; E3 0.4,-0.8
503480-2400_5034802400 = smd 0.3 x 0.7: 1 -5.75,1.525; 2 -5.25,1.525; 3 -4.75,1.525; 4 -4.25,1.525; 5 -3.75,1.525; 6 -3.25,1.525; 7 -2.75,1.525; 8 -2.25,1.525; 9 -1.75,1.525; 10 -1.25,1.525; 11 -0.75,1.525; 12 -0.25,1.525; 13 0.25,1.525; 14 0.75,1.525; 15 1.25,1.525; 16 1.75,1.525; 17 2.25,1.525; 18 2.75,1.525; 19 3.25,1.525; 20 3.75,1.525; 21 4.25,1.525; 22 4.75,1.525; 23 5.25,1.525; 24 5.75,1.525 | smd 0.3 x 1: MP1 -6.54,-1.125; MP2 6.54,-1.125
TC2030-IDC_TC2030IDC = smd 0.783 x 0.783: 1 -0.953,-0.635; 2 -0.953,0.635; 3 0.317,-0.635; 4 0.317,0.635; 5 1.588,-0.635; 6 1.588,0.635 | hole 2.451: -2.223,-2.54; -2.223,2.54; 0.952,-2.54; 0.952,2.54 | hole 1.067: -2.223,0; 2.857,-1.016; 2.857,1.016
KH-TYPE-C-16P_KINGHELM_KH-TYPE-C-16P = smd 0.6 x 1.15: A1_B12 -3.2,4.725; A4_B9 -2.4,4.725; A9_B4 2.4,4.725; A12_B1 3.2,4.725 | smd 0.3 x 1.15: A5 -1.25,4.725; A6 -0.25,4.725; A7 0.25,4.725; A8 1.25,4.725; B5 1.75,4.725; B6 0.75,4.725; B7 -0.75,4.725; B8 -1.75,4.725 | drill 0.65 pad 1.05: SH1 -4.32,0; SH2 4.32,0; SH3 -4.32,4.15; SH4 4.32,4.15 | hole 0.7: -2.89,3.65; 2.89,3.65
NORDIC_NRF_2_RESC0402_L = smd 0.5 x 0.6: 1 -0.5,0; 2 0.5,0
ESP32_C6_LIBRARY_2_IND_4828-WE-TPC_WRE = smd 0.9 x 5.3: 1 -2.286,0; 2 2.286,0
MLP2016SR47MT0S1_INDC2016X100N = smd 1.2 x 2.2: 1 -1.028,0; 2 1.028,0
ESP32_C6_LIBRARY_6_SOT65P210X110-3N = smd 1.05 x 0.5: 1 -1.05,0.65; 2 -1.05,-0.65; 3 1.05,0
CPF0201D7K68C1_0201 = smd 0.35 x 0.25: 1 0,0.275; 2 0,-0.275
ESP32_C6_LIBRARY_7_JUMPER_SJ = smd 1.168 x 1.6: 1 -0.762,0; 2 0.762,0
2025-10-22_07-23-44_LIBRARY_SW_EVP-AKE31A_PAN = smd 0.711 x 1.092: 1 -1.4,-0.972; 2 1.4,-0.972 | drill 0.559 pad 0.914 square: 3 -1.848,0.381; 4 1.848,0.381 | smd 1.397 x 1.092: 5 0,-1.124
HECTOR_WATCH_1_TP20R = smd 2 x 2: TP 0,0
NORDIC_NRF_4_AQFN50P700X700X85_HS-74N = smd 4.85 x 4.85: P$74 0,0 | drill 0.3 pad 0.6: P$75 -1.8,1.8; P$76 -0.6,1.8; P$77 0.6,1.8; P$78 1.8,1.8; P$79 -1.8,0.6; P$80 -0.6,0.6; P$81 0.6,0.6; P$82 1.8,0.6; P$83 -1.8,-0.6; P$84 -0.6,-0.6; P$85 0.6,-0.6; P$86 1.8,-0.6; P$87 -1.8,-1.8; P$88 -0.6,-1.8; P$89 0.6,-1.8; P$90 1.8,-1.8 | smd 0.2 x 0.2: P$A8 -1.25,3.25; P$A10 -0.75,3.25; P$A12 -0.25,3.25; P$A14 0.25,3.25; P$A16 0.75,3.25; P$A18 1.25,3.25; P$A20 1.75,3.25; P$A22 2.25,3.25; P$A23 2.75,3.25; P$AA24 3.25,-2.25; P$AB2 -2.75,-2.5; P$AC5 -2,-2.75; P$AC9 -1,-2.75; P$AC11 -0.5,-2.75; P$AC13 0,-2.75; P$AC15 0.5,-2.75; P$AC17 1,-2.75; P$AC19 1.5,-2.75; P$AC21 2,-2.75; P$AC24 3.25,-2.75; P$AD2 -2.75,-3.25; P$AD4 -2.25,-3.25; P$AD6 -1.75,-3.25; P$AD8 -1.25,-3.25; P$AD10 -0.75,-3.25; P$AD12 -0.25,-3.25; P$AD14 0.25,-3.25; P$AD16 0.75,-3.25; P$AD18 1.25,-3.25; P$AD20 1.75,-3.25; P$AD22 2.25,-3.25; P$AD23 2.75,-3.25; P$B1 -3.25,2.75; P$B3 -2.5,2.75; P$B5 -2,2.75; P$B7 -1.5,2.75; P$B9 -1,2.75; P$B11 -0.5,2.75; P$B13 0,2.75; P$B15 0.5,2.75; P$B17 1,2.75; P$B19 1.5,2.75; P$B24 3.25,2.75; P$C1 -3.25,2.25; P$D2 -2.75,2; P$D23 2.75,2; P$E24 3.25,1.75; P$F2 -2.75,1.5; P$F23 2.75,1.5; P$G1 -3.25,1.25; P$H2 -2.75,1; P$H23 2.75,1; P$J1 -3.25,0.75; P$J24 3.25,0.75; P$K2 -2.75,0.5; P$L1 -3.25,0.25; P$L24 3.25,0.25; P$M2 -2.75,0; P$N1 -3.25,-0.25; P$N24 3.25,-0.25; P$P2 -2.75,-0.5; P$P23 2.75,-0.5; P$R1 -3.25,-0.75; P$R24 3.25,-0.75; P$T2 -2.75,-1; P$T23 2.75,-1; P$U1 -3.25,-1.25; P$U24 3.25,-1.25; P$V23 2.75,-1.5; P$W1 -3.25,-1.75; P$W24 3.25,-1.75; P$Y2 -2.75,-2; P$Y23 2.75,-2
ESP32_C6_LIBRARY_SON50P200X200X80-9N = smd 0.76 x 0.27: 1 -0.985,0.75; 2 -0.985,0.25; 3 -0.985,-0.25; 4 -0.985,-0.75; 5 0.985,-0.75; 6 0.985,-0.25; 7 0.985,0.25; 8 0.985,0.75 | smd 0.9 x 1.3: 9 0,0
NORDIC_NRF_BT-XTAL_2016_N = smd 0.95 x 0.85: 1 -0.725,-0.575; 2 0.725,-0.575; 3 0.725,0.575; 4 -0.725,0.575
NORDIC_NRF_1_XTAL_3215_N = smd 1 x 1.8: 1 -1.25,0; 2 1.25,0

### Placement (x,y rotation side)
ANT1  43.65,17.82 0 top
C1  39.69,19.43 0 top
C1-EP-DR  18.33,24.24 0 top
C2  39.74,20.79 0 top
C2-EP-DR  6.16,33.27 180 top
C3  35.14,17.75 270 top
C4  38.68,16.65 270 top
C5  24.25,22.66 180 top
C6  21.05,15.86 180 top
C7  33.26,9.2 270 top
C8  37.96,9.85 90 top
C9  37.19,14.63 0 top
C10  36.2,23.11 0 top
C11  34.8,22.45 180 top
C12  33.4,22.46 0 top
C13  32.19,22.32 90 top
C14  25.13,23.66 90 top
C15  28.75,23.66 0 top
C16  30.89,23.31 90 top
C17  20.86,20.71 0 top
C18  20.71,19.11 0 top
C19  16.54,20.48 90 top
C20  21,14.84 180 top
C21  23.55,14.24 180 top
C22  39.71,16.66 270 top
C23  6.65,4.25 90 top
C24  5.79,3.96 90 top
C25  3.19,7.49 180 top
C27  30.45,5.91 90 top
C29  35.35,5.09 90 top
C30  14.35,5.65 90 top
C31  24.35,5.09 270 top
C32  19.55,10.07 270 top
C33  5.66,9.41 90 top
C34  18.93,13.45 180 top
C37  23.03,9.35 0 top
C38  26.85,10.51 90 top
C39  25.41,8.79 270 top
C42  41.73,7.85 0 top
C43  39.06,7.37 270 top
D2  3.83,28.23 180 top
D3  20.93,24.35 270 top
D4  3.9,30.17 0 top
D5  4.14,25.97 0 top
DMG2305UX-7  43.68,11.62 270 top
EPD_C1  11.96,21.06 180 top
EPD_C2  12.45,22.09 180 top
EPD_C5  13.59,17.76 180 top
EPD_C6  13.74,16.83 180 top
EPD_C7  14.12,15.71 180 top
EPD_C8  13.71,14.68 180 top
EPD_C9  13.5,13.65 180 top
EPD_C10  13.8,12.72 180 top
EPD_C11  13.77,11.8 180 top
EPD_C12  13.51,10.87 180 top
IC1  23.97,10.85 270 top
IC2  18.04,10.43 270 top
IC3  17.76,17.83 0 top
IC9  6.14,6.42 180 top
J1  8.9,17.5 270 top
J2  38.3,28.48 180 top
J4  22.17,33.66 180 top
L1  36.81,16.86 0 top
L2  27.47,24.03 90 top
L3  27.98,26.01 0 top
L5  14.38,26.75 270 top
L7  12.33,8.12 90 top
Q3  9.56,32.09 90 top
R1_EP_DR1  10.45,30.09 270 top
R1_USB  23.43,27.65 180 top
R2  8.33,8.65 0 top
R2_EP_DR  8.65,30.09 90 top
R2_USB  20.45,27.64 0 top
R3  16.89,16.15 180 top
R4  8.95,7.27 270 top
R5  10.95,5.33 90 top
R7  32.25,5.11 270 top
R8  21.55,5.15 180 top
R9  21.75,10.95 180 top
R17  4.79,1.95 180 top
R18  2.6,3.69 0 top
R_PWR_EPD  40.43,10.95 0 top
R_TYPE_SEL  15.81,32.65 180 top
SJ1  13.93,32.12 90 top
SW_DN  33.95,2.99 180 top
SW_ENT  22.95,2.99 180 top
SW_UP  12.05,2.99 180 top
TP_3.3V  39.56,33.64 0 top
TP_3V3  33.58,33.72 180 top
TP_BAT_GND  38.78,1.89 0 top
TP_GND  42.72,3.35 0 top
TP_ON  16.32,1.48 90 top
TP_OP  18.45,1.55 270 top
TP_RESET  29.94,33.26 0 top
TP_SCL  8.3,1.28 0 top
TP_SDA  1.28,9.32 0 top
TP_SWDCLK  44.1,30.22 0 top
TP_SWDIO  44.04,25.49 0 top
TP_SWO  35.72,10.09 90 top
TP_VBAT  33.69,6.42 0 top
TP_VREG  22.28,7.22 0 top
U1  30.55,16.77 0 top
U3  30.39,8.61 90 top
X1  36.97,20.18 90 top
X2  23.39,19.78 270 top

### Tracks (layer width: path | path; a pad name or v marks a point on that pad's centre or on a via)
3V3  (via drill 0.1 pad 0.1, 0.2 pad 0.1, 0.3 pad 0.1, 0.3 pad 0.3)
  Top 0.15: v16.2,10.4 16.23,10.43 IC2.C2 | C34.2 18.74,12.95 v18.5,12.7 | IC3.10 16.54,19.07 C19.1 17.38,19.98 v17.5,20.1 | IC3.7 18.51,20.09 v18.5,20.1 | IC3.3 18.01,16.39 v18.4,16
  Top 0.3: R18.2 3.1,2.92 v3.1,2.9 | v4.7,2.9 4.79,2.81 R17.2 | C25.1 4.61,7.49 v4.7,7.4 | v4.7,7.4 4.89,7.21 5.73,7.21 IC9.E3 IC9.E2 | v4.7,7.4 4.7,7.95 C33.1 6.11,8.91 v6.7,9.5 | TP_3V3.TP 34.98,33.72 v35,33.7 | v37.9,33.6 39.52,33.6 TP_3.3V.TP 39,33.08 v39,32.1 | J2.1 38.9,29.47 v38.9,30 | DMG2305UX-7.2 41.83,10.67 v41.8,10.7 | v41.1,10.7 40.45,10.7 R_PWR_EPD.2 | C8.1 v38.8,9.59 v38.8,9.6 | C7.1 33.84,9.46 v33.9,9.4 | v22.1,15.8 21.36,15.8 C6.1 21.3,16.5 21.1,16.7 19.1,16.7 v18.4,16 | v33.1,21.7 33.1,22.41 C12.1 33.1,22.5 33.1,24.8 v33.3,25 | C14.1 25.9,22.63 v25.9,22.6
  Route15 0.127: 31.6,11.7 31.6,12.72 U1.P$AD14 | U1.P$Y2 27.8,14.37 | v27.3,15.02 27.3,14.77 27.35,14.72
  Route15 0.15: v18.5,12.7 18.1,12.3 17.3,12.3 16.2,11.2 v16.2,10.4 | v18.4,16 17.6,16.8 17.6,20.1
  Route15 0.3: v3.1,2.9 v4.7,2.9 3.7,3.9 3.7,6.4 v4.7,7.4 | v37.9,33.6 37.8,33.7 v35,33.7 33.3,32 v33.3,25 | v38.9,30 38.9,30.34 38.92,30.37 38.92,32.02 v39,32.1 | v41.8,10.7 41.2,10.7 | 41.2,10.7 v41.1,10.7 | 41.2,10.7 40.1,9.6 v38.8,9.6 38.6,9.4 v33.9,9.4 33.3,10 33.3,11.2 | 25,15.02 22.88,15.02 v22.1,15.8 | 25,15.02 25,17.21 v27.3,19.52 | 25,15.02 25,14.72 27.35,14.72 27.7,14.37 27.8,14.37 31.2,14.37 32.05,13.52 v33.3,13.52 33.3,11.2 | v33.1,21.7 32.8,21.41 v32.8,20.02 32.22,20.6 28.39,20.6 v27.3,19.52 | v25.9,22.6 27.3,21.2 v27.3,19.52 | v16.2,10.4 15.3,9.5 v6.7,9.5 | v17.5,20.1 17.6,20.1 v18.5,20.1 18.4,20.1 v18.4,16 18.4,12.8 v18.5,12.7 | 33.3,11.2 32.8,11.7 31.6,11.7
  other vias: 30.8,13.52 27.8,14.77
3V3/1.7D  (via drill 0.3 pad 0.3)
  Top 0.15: v31.1,4 31.97,4.88 R7.2
  Top 0.3: R5.2 12.27,5.33 v12.3,5.3 | v20.5,5.3 21.42,5.3 R8.2 22.38,5.43 v22.4,5.4
  Route15 0.3: v12.3,5.3 v20.5,5.3 | v22.4,5.4 27.5,5.4 28.3,4.6 29,3.9 29.8,3.9 31,3.9 v31.1,4
ALERT  (via drill 0.35)
  Top 0.15: U3.5 32.64,8.1 38,8.1 39.1,9.2 v40.8,9.2 | v34.5,17.1 34.08,17.52 U1.P$J24
  Bottom 0.15: v40.8,9.2 40,10 40,12.2 35.1,17.1 v34.5,17.1
D+  (via drill 0.3)
  Top 0.127: D3.4 18.68,21.8 15.5,21.8 15.1,21.4 15.1,14.3 16.1,13.3 v17.9,13.3 | v28.8,12.1 U1.P$AD6
  Bottom 0.127: v17.9,13.3 19.8,13.3 20.9,12.2 28.7,12.2 v28.8,12.1
D-  (via drill 0.3)
  Top 0.127: U1.P$AD4 28.3,11.89 28.7,11.5 29.5,11.5 30.8,10.2 34.1,10.2 34.5,9.8 34.5,8.8 34.6,8.7 37.2,8.7 37.3,8.8 37.3,11.3 38.4,12.4 39.5,12.4 40.3,13.2 v40.3,13.3 | v40.1,23 39,24.1 36,24.1 33.3,26.8 25.4,26.8 21.88,23.28 D3.6
  Bottom 0.127: v40.3,13.3 40.1,13.5 v40.1,23
DEC1
  Top 0.15: U1.P$C1 27.1,19.02 24.5,21.62 C5.1
DEC3  (via drill 0.2, 0.3)
  Top 0.127: v34.6,21.5 34.6,21.6 35.05,22.05 C11.1
  Bottom 0.127: v33.3,18.77 33.74,19.2 34.2,19.2 34.6,19.6 v34.6,21.5
DEC4_6  (via drill 0.2, 0.3)
  Top 0.15: 28.49,25.99 L3.2 33.05,26.01 C10.1 35.95,22.34 v35.4,21.8 | 28.49,25.99 C15.1 28.55,23.6 U1.P$B5 | C16.1 30.84,23.1 30.2,23.1 29.8,23.5 29.8,24.9 28.71,25.99 28.49,25.99
  Bottom 0.15: v33.8,18.52 34.82,18.52 35.4,19.1 v35.4,21.8
DN
  Top 0.127: J4.A7 21.92,28.18 22.2,27.9 22.4,27.9 | 22.4,27.9 22.6,27.9 22.92,28.22 J4.B7 | D3.1 21.88,27.38 22.4,27.9
DP
  Top 0.127: J4.A6 22.42,29.48 22.1,29.8 21.7,29.8 21.42,29.52 J4.B6 21.42,27.32 20.9,26.8 20.6,26.8 19.98,26.18 D3.3
EPD_3V3  (via drill 0.3 pad 0.3)
  Top 0.3: v14.4,23.5 14.38,23.52 L5.2 14.61,24.24 C1-EP-DR.1 18,24.41 v18,26.1 | v13.1,18.7 EPD_C5.2 | DMG2305UX-7.3 44.78,12.58 v44.8,12.6 | J1.16 J1.15 9.35,16.25 v9.3,16.2
  Route15 0.3: v14.4,23.5 14.4,20 v13.1,18.7 11,18.7 9.3,17 v9.3,16.2 | v44.8,12.6 44.3,12.6 40.1,16.8 40.1,24 39.8,24.3 31.3,24.3 28.5,27.1 19,27.1 v18,26.1
EPD_BUSY  (via drill 0.3)
  Top 0.127: U1.P$AD12 30.3,12.71 v29.9,12.3 | v8.4,19.2 8.45,19.25 J1.9
  Bottom 0.127: v29.9,12.3 29.9,11.7 26.1,7.9 14.1,7.9 12.9,9.1 8.5,9.1 7.8,9.8 7.8,18.6 v8.4,19.2
EPD_CS  (via drill 0.2, 0.3)
  Top 0.127: J1.12 11.35,17.75 v11.4,17.7 | v16.3,16.2 16.3,14.6 16.7,14.2 21.8,14.2 23.1,15.5 v25.7,15.5
  Bottom 0.127: v16.3,16.2 12.9,16.2 v11.4,17.7 | U1.P$K2 27.57,17.27 25.8,15.5 v25.7,15.5
  other vias: 27.8,17.27
EPD_DC  (via drill 0.2, 0.3)
  Top 0.127: v9.6,18.7 10.05,18.25 J1.11
  Bottom 0.127: U1.P$AD10 29.3,13.02 27.4,13.02 19.82,20.6 11.5,20.6 v9.6,18.7
  other vias: 29.8,13.52
EPD_RST  (via drill 0.3)
  Top 0.127: U1.P$AC11 30.05,13.16 v29.8,12.9 | v11.2,19.2 10.75,18.75 J1.10
  Bottom 0.127: v29.8,12.9 29.5,12.6 22,12.6 19.6,15 19.6,16.2 16.5,19.3 11.3,19.3 v11.2,19.2
GDR  (via drill 0.3)
  Top 0.127: v9.8,28.6 9.8,29.21 R2_EP_DR.2 8.91,30.11 Q3.1 | v11.2,23.4 11.1,23.3 11.1,23 10.85,22.75 J1.2
  Bottom 0.127: v9.8,28.6 11.2,27.2 v11.2,23.4
GND  (via drill 0.3)
  Top 0.127: EPD_C8.1 14.62,15.09 EPD_C7.1 14.24,16.09 EPD_C6.1 | IC9.C2 IC9.C1 | C6.2 20.79,14.89 C20.2 19.14,14.84 v19.1,14.8 | U3.6 30.64,8.86 U3.9 | EPD_C8.1 14.21,13.86 EPD_C9.1 14.3,13.35 EPD_C10.1 14.3,11.83 EPD_C11.1 14.27,11.13 EPD_C12.1 14.2,10.68 v14.2,8.9 | EPD_C8.1 14.21,14.49 v15,13.7 | v9.4,14.8 9.85,15.25 J1.17 | v16,8.5 16,5.1 15.7,4.8 15.01,4.8 C30.1 14.35,4.86 SW_UP.1 | C7.2 33.75,8.95 v34,8.7 | v32.3,7.6 31.17,7.6 U3.4 | v20,13.7 19.75,13.45 C34.1 | IC3.8 18.01,19.29 v18,19.3 | v19.4,19.3 20.26,19.3 C18.1 | C32.1 20.24,10.25 20.3,10.2 | 20.3,10.2 20.3,9.6 v19.8,9.1 | v18.1,9.1 18.04,9.16 IC2.B3 | IC2.B1 18.81,11.7 v19,11.7 | v20.1,11.2 20.3,11 20.3,10.2 | U1.P$74 U1.P$81 | C10.2 38.79,23.11 40,21.9 44,21.9 v44.5,22.4 | v35.2,31.3 35.2,31 36.71,29.49 J2.5
  Top 0.15: J2.5 J2.3 | U1.P$F23 32.66,18.27 U1.P$78 | U1.P$B7 29.05,18.87 U1.P$75
  Bottom 0.127: v15,13.7 10.5,13.7 v9.4,14.8 | v14.2,8.9 14.6,8.5 v16,8.5 | v34,8.7 32.9,7.6 v32.3,7.6 | v19.1,14.8 20,13.9 v20,13.7 | v18,19.3 v19.4,19.3 | v19.8,9.1 v18.1,9.1 | v19,11.7 19.6,11.7 v20.1,11.2 | v44.5,22.4 44.5,30.4 41.5,33.4 38.9,33.4 38.3,32.8 36.7,32.8 v35.2,31.3
  pour Top: -0.12,4.13 3.53,0.48 4.22,0.48 4.24,0.46 4.73,-0.02 41.97,-0.02 46.12,4.13 46.12,16.32 40.98,16.32 40.96,16.34 40.94,16.36 40.92,16.38 40.92,19.32 40.94,19.34 40.96,19.36 40.98,19.38 46.02,19.38 46.02,31.07 42.07,35.02 3.93,35.02 -0.12,30.97
  pour Route2: -0.12,4.13 3.53,0.48 4.22,0.48 4.24,0.46 4.73,-0.02 41.97,-0.02 46.12,4.13 46.12,16.32 40.98,16.32 40.96,16.34 40.94,16.36 40.92,16.38 40.92,19.32 40.94,19.34 40.96,19.36 40.98,19.38 46.02,19.38 46.02,31.07 42.07,35.02 3.93,35.02 -0.12,30.97
  pour Bottom: -0.12,4.13 3.53,0.48 4.22,0.48 4.24,0.46 4.73,-0.02 41.97,-0.02 46.12,4.13 46.12,16.32 40.98,16.32 40.96,16.34 40.94,16.36 40.92,16.38 40.92,19.32 40.94,19.34 40.96,19.36 40.98,19.38 46.02,19.38 46.02,31.07 42.07,35.02 3.93,35.02 -0.12,30.97
HAPTIC_EN
  Top 0.127: U1.P$U1 27.1,15.52 23.89,12.3 20.41,12.3 19.04,10.93 IC2.A1
IMU_INT1
  Top 0.127: U1.P$N1 21.88,16.52 20.82,17.58 IC3.5
IMU_INT2  (via drill 0.3)
  Top 0.127: U1.P$P2 26.97,16.27 26.7,16 v23.6,16 | v19.3,18.2 18.66,18.2 IC3.6
  Bottom 0.127: v23.6,16 20.7,18.9 20,18.9 v19.3,18.2
LX1  (via drill 0.3 pad 0.1)
  Top 0.15: IC9.B2 IC9.B3 5.44,6.02 5.02,5.6 v4.7,5.6 | v10.5,6.8 12.03,6.8 L7.1
  Bottom 0.15: v4.7,5.6 6.8,5.6 8,6.8 v10.5,6.8
LX2  (via drill 0.3 pad 0.1)
  Top 0.15: IC9.D2 IC9.D3 5.02,6.82 v4.7,6.5 | L7.2 11.78,8.6 v10.4,8.6
  Bottom 0.15: v10.4,8.6 9.7,7.9 6.1,7.9 v4.7,6.5
MOSI  (via drill 0.2, 0.3)
  Top 0.127: J1.14 10.57,16.9 12.1,16.9 12.5,17.3 12.5,19.3 15.5,22.3 v16,22.3
  Bottom 0.127: v16,22.3 16.4,22.7 24.8,22.7 26.3,21.2 29.2,21.2 30.55,19.84 U1.P$B13
  other vias: 30.55,19.52
N$1  (via drill 0.2, 0.3)
  Top 0.127: v27.1,14 26.4,14 v25.5,13.1 | v22.1,15.1 21.51,15.1 C20.1
  Bottom 0.127: U1.P$AC5 27.12,14.02 v27.1,14 | v25.5,13.1 24.9,13.1 22.9,15.1 v22.1,15.1
  other vias: 28.55,14.02
N$2
  Top 0.15: U1.P$N24 33.92,16.4 34.7,16.4 36.3,14.8 36.3,14.7 36.37,14.63 C9.1
N$3
  Top 0.15: L1.1 36.31,17.03 35.34,18 C3.1 35.04,18.1 33.8,18.1 33.47,17.77 U1.P$H23
N$4
  Top 0.15: C1.1 39.41,19.46 X1.1 37.54,18.84 37.3,18.6 36.02,18.6 34.91,19.72 34,19.72 U1.P$B24
N$5
  Top 0.15: C2.1 38.38,21.9 37.1,21.9 36.39,21.19 X1.3 36.09,20.61 33.89,20.61 U1.P$A23
N$6
  Top 0.15: L2.1 28.05,22.95 U1.P$B3
N$7
  Top 0.15: L3.1 L2.2
N$8
  Top 0.127: U1.P$A18 31.8,21.68 C13.1
N$9
  Top 0.15: R9.2 23.2,11.22 IC1.D1
N$10
  Top 0.15: IC9.D1 8.23,6.82 R4.2
N$11
  Top 0.15: IC9.E1 7.69,8.38 R2.2
N$12
  Top 0.15: C2-EP-DR.2 4.2,31.81 4.2,27.3 5.53,25.97 D5.2 11.31,25.97 L5.1
N$13
  Top 0.15: D2.1 5.65,28.3 D4.2 6.66,31.18 C2-EP-DR.1 9.43,33.27 Q3.3
N$14
  Top 0.15: R_TYPE_SEL.2 13.97,32.92 SJ1.2 13.52,32.88 R1_EP_DR1.1
N$15
  Top 0.15: IC3.1 17.01,16.55 R3.2
N$16
  Top 0.15: C32.2 19.08,9.88 IC2.A2
N$17
  Top 0.127: J4.A5 23.43,28.93 R1_USB.2
N$18
  Top 0.15: J1.4 11.61,21.75 EPD_C2.2
N$19
  Top 0.127: J4.B5 20.45,28.91 R2_USB.1
N$20
  Top 0.15: J1.5 11.27,21.25 EPD_C1.2
N$21
  Top 0.15: J1.18 11.35,14.75 12.5,15.9 12.5,16.4 12.93,16.83 EPD_C6.2
N$22
  Top 0.15: J1.19 11.55,14.25 13.01,15.71 EPD_C7.2
N$23
  Top 0.15: J1.20 11.75,13.75 12.68,14.68 EPD_C8.2
N$24
  Top 0.15: J1.22 13.27,12.75 EPD_C10.2
N$26
  Top 0.15: J1.24 12.13,11.75 EPD_C12.2
OUT+
  Top 0.15: IC2.A3 18.54,1.64 TP_OP.TP
OUT-
  Top 0.15: IC2.C3 17.54,2.69 TP_ON.TP
P0.01/XL1
  Top 0.127: C17.2 23.06,20.71 X2.1
  Top 0.15: U1.P$D2 27.48,18.77 27.43,18.72 26.38,18.72 24.07,21.03 X2.1
P0.01/XL2
  Top 0.15: U1.P$F2 27.48,18.27 27.43,18.32 23.6,18.32 X2.2 22.81,19.11 C18.2
P0.13  (via drill 0.3)
  Top 0.127: U1.P$AD8 29.3,12.29 30.9,10.7 v31.2,10.7 | v15.4,5.8 14.38,5.8 C30.2
  Top 0.15: SW_UP.2 10.67,3.99 R5.1 10.67,5.53 10.99,5.85 C30.2
  Bottom 0.127: v31.2,10.7 26.4,5.9 15.5,5.9 v15.4,5.8
P0.14  (via drill 0.2 pad 0.1, 0.3 pad 0.1)
  Top 0.127: C31.2 21.58,4.9 R8.1 SW_ENT.2 | SW_ENT.2
  Top 0.15: v28.1,9.3 25.5,6.7 25.5,5.4 25,4.9 C31.2
  Bottom 0.15: U1.P$AC9 30.05,14.02 30.4,13.67 30.4,11.6 v28.1,9.3
  other vias: 29.55,14.02
P1.01  (via drill 0.2 pad 0.1, 0.3 pad 0.1)
  Top 0.15: DMG2305UX-7.1 41.33,11.22 R_PWR_EPD.1 39.38,11.22 v39.1,11.5
  Bottom 0.15: v33.3,14.77 36.83,14.77 39.1,12.5 v39.1,11.5
P1.02  (via drill 0.3 pad 0.1)
  Top 0.15: SW_DN.2 32.55,5.09 R7.1 34.39,5.11 34.4,5.1 35.03,5.1 35.15,5.22 35.29,5.22 C29.2 35.35,5.95 v35.3,6 | U1.P$W24 35.38,15.02 35.7,14.7 v35.7,14.2
  Bottom 0.15: v35.7,14.2 35.3,13.8 v35.3,6
PMIC_INT  (via drill 0.3)
  Top 0.127: U1.P$T2 26.87,15.77 25.5,14.4 v25.3,14.4 | v26.4,13.4 26.4,12.88 IC1.A1
  Bottom 0.127: v25.3,14.4 26.3,13.4 v26.4,13.4
PREVGH  (via drill 0.3)
  Top 0.127: D5.1 3.56,24.8 v7.6,24.8 | v8.4,18.3 8.4,14.5 9.65,13.25 J1.21
  Top 0.15: J1.21 12.6,13.25 EPD_C9.2
  Bottom 0.127: v7.6,24.8 9,23.4 9,19.2 8.4,18.6 v8.4,18.3
PREVGL
  Top 0.127: D2.2 5.01,25.3 8,25.3 9,24.3 9,20.7 7.9,19.6 7.9,14.1 9.75,12.25 10.5,12.25
  Top 0.15: EPD_C11.2 12.7,11.8 12.25,12.25 10.5,12.25 J1.23
RESE  (via drill 0.3)
  Top 0.127: J1.3 11.05,22.25 12.1,23.3 v12.1,23.4 | v11.1,29.1 10.17,30.02 R1_EP_DR1.2 10.17,31.01 Q3.2
  Bottom 0.127: v12.1,23.4 12.1,28.1 v11.1,29.1
RESET  (via drill 0.3)
  Top 0.127: U1.P$AC13 30.55,12.84 31.1,12.3 v32.1,12.3 | v34.5,12.2 v37.1,12.2 | v36.7,14 38,14 38.6,14.6 v38.6,15.6 | v35.5,26.1 35.5,26.3 36.71,27.51 J2.6
  Top 0.15: J2.6 35.87,28.69 35.11,28.69 30.53,33.26 TP_RESET.TP
  Bottom 0.127: v32.1,12.3 34.4,12.3 v34.5,12.2 | v37.1,12.2 36.7,12.6 v36.7,14 | v38.6,15.6 38.3,15.9 38.3,23.5 37.6,24.2 36.2,24.2 35.5,24.9 v35.5,26.1
RF
  Top 0.15: L1.2 38.64,16.86 | 38.64,16.86 C4.1 | 38.64,16.86 39.66,16.86 C22.1 40.62,17.82 ANT1.1
SCK  (via drill 0.3)
  Top 0.127: J1.13 11.95,17.25 12.2,17.5 12.2,19.6 15.6,23 v15.9,23 | v30.3,21.6 v30.3,21.59 U1.P$A12
  Bottom 0.127: v30.3,21.6 28.8,23.1 16,23.1 v15.9,23
SCL  (via drill 0.1 pad 0.1, 0.2, 0.3, 0.3 pad 0.1, 0.35)
  Top 0.127: IC3.12 15.88,17.58 15.8,17.5 | 15.8,17.5 v15.8,14.3 | v15.6,11.6 15.6,10.96 15.63,10.93 | v21.8,19.9 19.5,19.9 17.9,21.5 16,21.5 15.8,21.3 15.8,17.5
  Top 0.15: R17.1 7.9,1.68 8.29,1.29 | 8.29,1.29 TP_SCL.TP | 8.29,1.29 9.22,2.22 R4.1 10.05,8.1 14.6,8.1 15.2,8.7 15.2,10.5 15.63,10.93 IC2.C1 17.54,11.53 17.8,11.79 18.4,11.79 19.31,12.7 v19.7,12.7 | U3.7 30.14,9.9 28.94,11.1 v28.1,11.1
  Bottom 0.127: v15.8,14.3 15.8,11.8 v15.6,11.6 | U1.P$M2 28.2,17.16 28.2,18 26.3,19.9 v21.8,19.9
  Bottom 0.15: v19.7,12.7 20.6,11.8 23.42,11.8 IC1.B1 24.27,11.15 28.05,11.15 v28.1,11.1
  other vias: 24.17,11.05 27.8,16.77
SDA  (via drill 0.3, 0.3 pad 0.1, 0.3 pad 0.3, 0.35)
  Top 0.127: U1.P$L1 22.02,17.02 v22,17 | v20.1,15.9 19.1,15.9 18.7,15.5 v17.4,15.5
  Top 0.15: v7.3,8.8 8.2,8.8 R2.1 8.33,9.93 v8.6,10.2 | v3.1,9.3 1.3,9.3 TP_SDA.TP | v17.4,15.5 17.4,16.94 IC3.2 | IC1.C1 23.77,11.33 23.5,11.6 21.4,11.6 v20.8,11 | U3.8 29.14,10.1 v27.6,10.1
  Top 0.3: TP_SDA.TP 1.28,7.92 v1.3,7.9 | v2.6,4.5 R18.1
  Route15 0.3: v1.3,7.9 1.3,5.8 v2.6,4.5
  Bottom 0.127: v22,17 21.2,17 v20.1,15.9
  Bottom 0.15: v7.3,8.8 3.6,8.8 v3.1,9.3 | IC2.B2 17.01,9.4 9.4,9.4 v8.6,10.2 | IC2.B2 17.4,11.07 v17.4,15.5 | IC2.B2 20.23,10.43 v20.8,11 21.6,10.2 27.5,10.2 v27.6,10.1
  other vias: 18.04,10.43
SWDCLK  (via drill 0.3 pad 0.1)
  Top 0.15: U1.P$AA24 34.38,14.52 35.4,13.5 38.2,13.5 39.6,14.9 v39.6,15 | v38.9,26.9 37.98,27.82 J2.4 | TP_SWDCLK.TP 43,29.12 v43,28.7
  Bottom 0.15: v39.6,15 39.3,15.3 39.3,24.1 39.6,24.4 | 39.6,24.4 39.6,24.74 38.9,25.44 v38.9,26.9 | v43,28.7 43,27.8 42.02,26.82 42.02,25.32 41.14,24.44 39.64,24.44 39.6,24.4
SWDIO  (via drill 0.3 pad 0.1)
  Top 0.15: J2.2 39.75,27.84 40,27.6 42.5,27.6 44.04,26.06 TP_SWDIO.TP 43.2,24.65 v43.2,23.8 | U1.P$AC24 34.92,12.9 38.7,12.9 v40.7,14.9
  Bottom 0.15: v40.7,14.9 40.7,21.3 v43.2,23.8
SWO
  Top 0.15: U1.P$AD22 32.8,12.39 35.11,10.09 TP_SWO.TP
VBAT  (via drill 0.3 pad 0.3)
  Top 0.15: C27.2 v31.2,6.1 | IC1.C2 23.87,10.55 23.87,10.32 24.2,9.99 v24.2,9.6 | 23.95,9.35 C37.2
  Top 0.3: v32.1,6.1 33.37,6.1 TP_VBAT.TP | U3.2 U3.3 30.64,6.66 v31.2,6.1 | 23.95,9.35 v24.2,9.6
  Route15 0.3: v32.1,6.1 v31.2,6.1 31.2,5.4 30.7,4.9 29.6,4.9 28.9,4.9 v24.2,9.6
VBUS  (via drill 0.1 pad 0.1, 0.3, 0.3 pad 0.1, 0.3 pad 0.3)
  Top 0.15: v26.2,10.7 C38.2 | C42.1 40.95,7.85 v40.9,7.8
  Top 0.3: J4.A4_B9 24.35,29.16 24.35,29.63 23.68,30.29 20.65,30.29 19.99,29.63 19.99,29.16 J4.A9_B4 19.77,28.17 19.2,27.6 v18.3,27.6 | D3.5 20.93,22.03 v20.9,22 | C21.1 v23.8,13.5 | v40,7.8 39.13,7.8 C43.1
  Route15 0.3: v18.3,27.6 17.1,27.6 16.5,27 16.5,23.2 17.7,22 v20.9,22 20.9,15.7 23.1,13.5 23.12,13.5 23.56,13.06 | 23.56,13.06 24.77,11.85 24.77,10.85 IC1.A2 24.62,10.7 v26.2,10.7 | 27.1,11.6 27.8,12.3 U1.P$AD2 | v40.9,7.8 v40,7.8 33.4,7.8 32.6,8.6 32.6,10.1 31.1,11.6 27.1,11.6 | 23.56,13.06 23.56,13.26 v23.8,13.5 | v26.2,10.7 27.1,11.6 | v26.2,10.7 27.1,11.6
  other vias: 24.57,10.65 27.8,13.52
VREG  (via drill 0.3 pad 0.3)
  Top 0.15: C24.2 6.62,4.46 C23.2 | IC1.B2 24.17,10.53 C39.1
  Top 0.3: C24.2 5.79,5.57 IC9.A3 IC9.A2 IC9.A1 6.56,5.6 v7.7,5.6 | v20.5,7.1 22.15,7.1 TP_VREG.TP 23.34,7.22 C39.1
  Route15 0.3: v20.5,7.1 19.5,6.1 15.7,6.1 8.2,6.1 v7.7,5.6
(copper drawn outside any net)
  shapes: Top area x1